# EAGLE board NAMUR (EAGLE 9.6.2)
ВНАР.301411.138 Сателлит-Р. Плата субблока ВТИ-8 (Р05)
NOABS_DPI: 600; NOABS_FINISH: ENIG (gold); NOABS_LEAVE_ARTIFACTS: 0; NOABS_MASK: Blue; NOABS_MERGE: 1; NOABS_MIN_PRIORITY3D: 0; NOABS_PHOTO_VIAS: 1; NOABS_SILK: White; RAILS_ANGLE: 180.000000; RAILS_WIDTH: 0.000000; RAILS_X: 22.500000; RAILS_Y: 75.500000
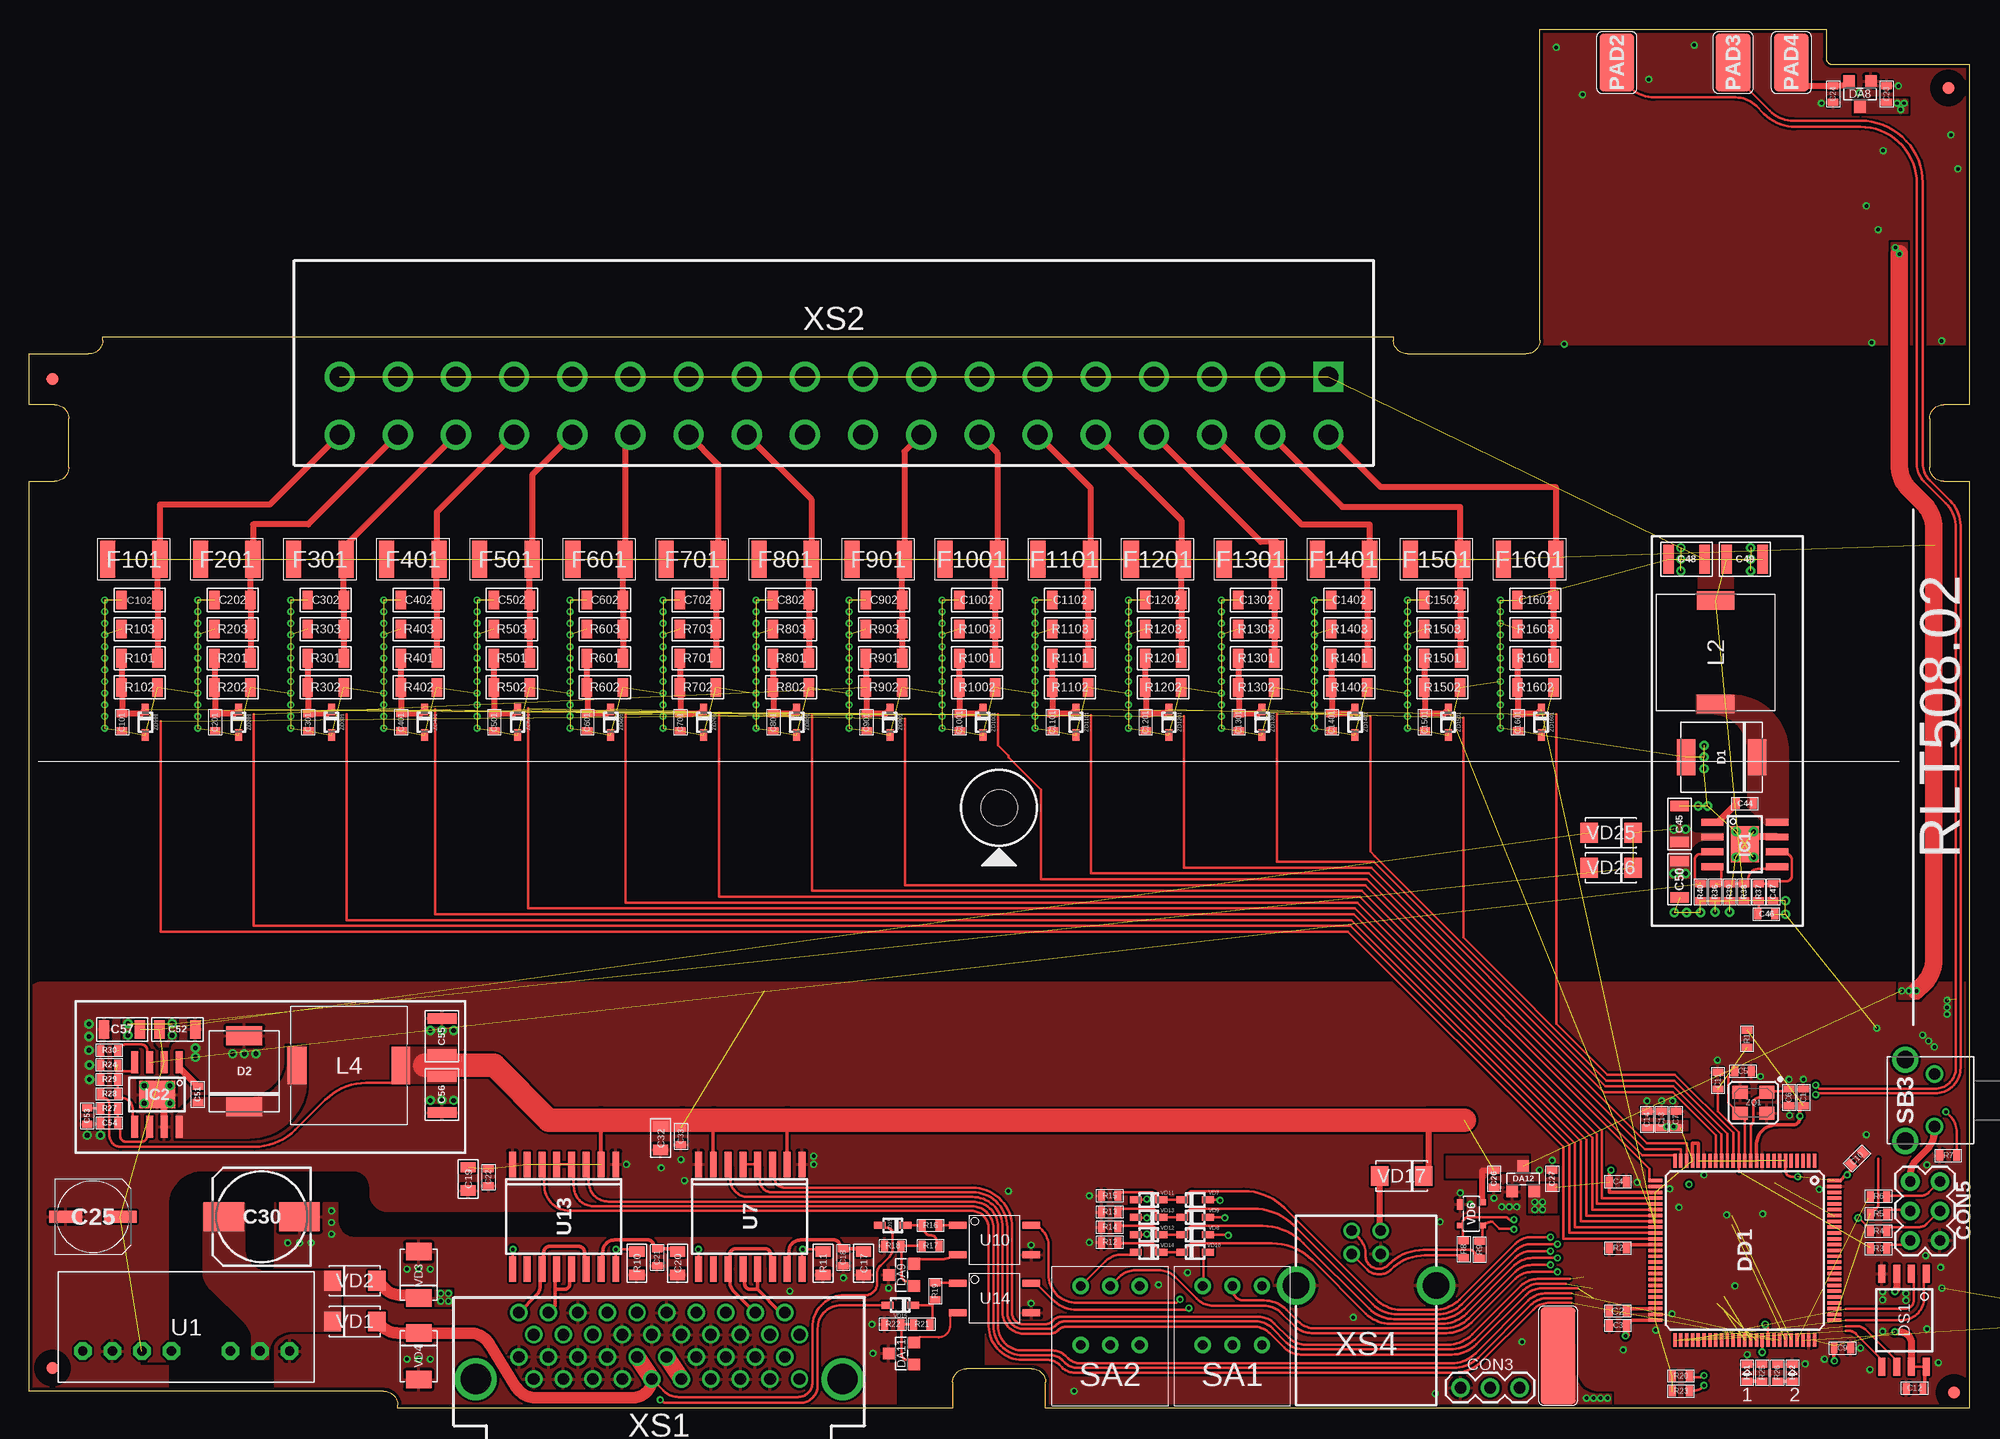
[diagram p6: board, top side]
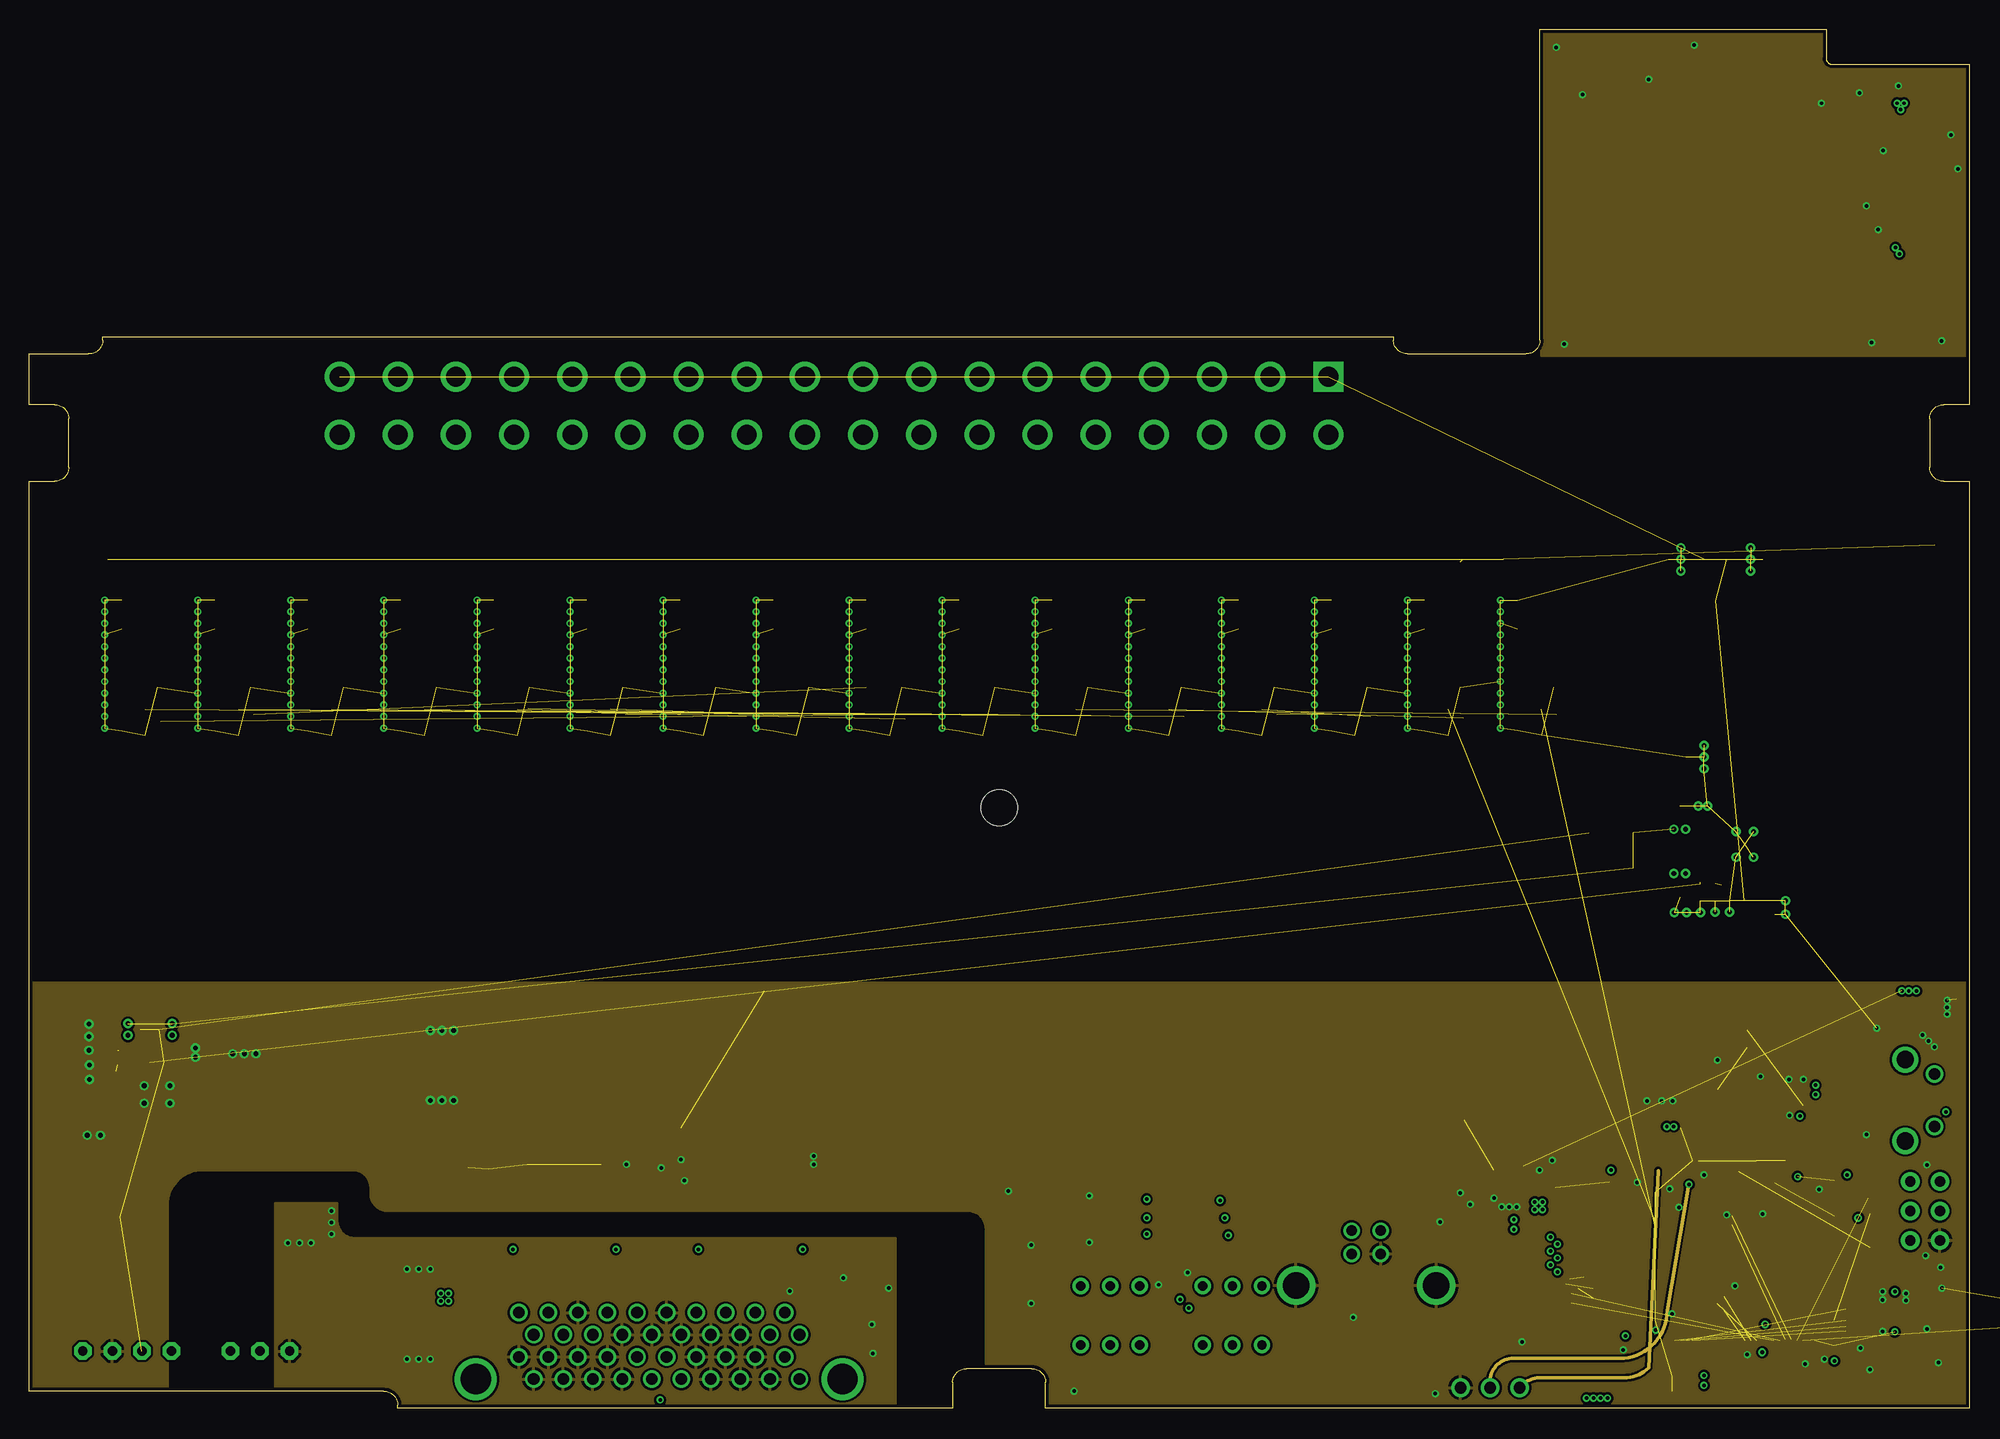
[diagram p7: board, inner layer Route2]
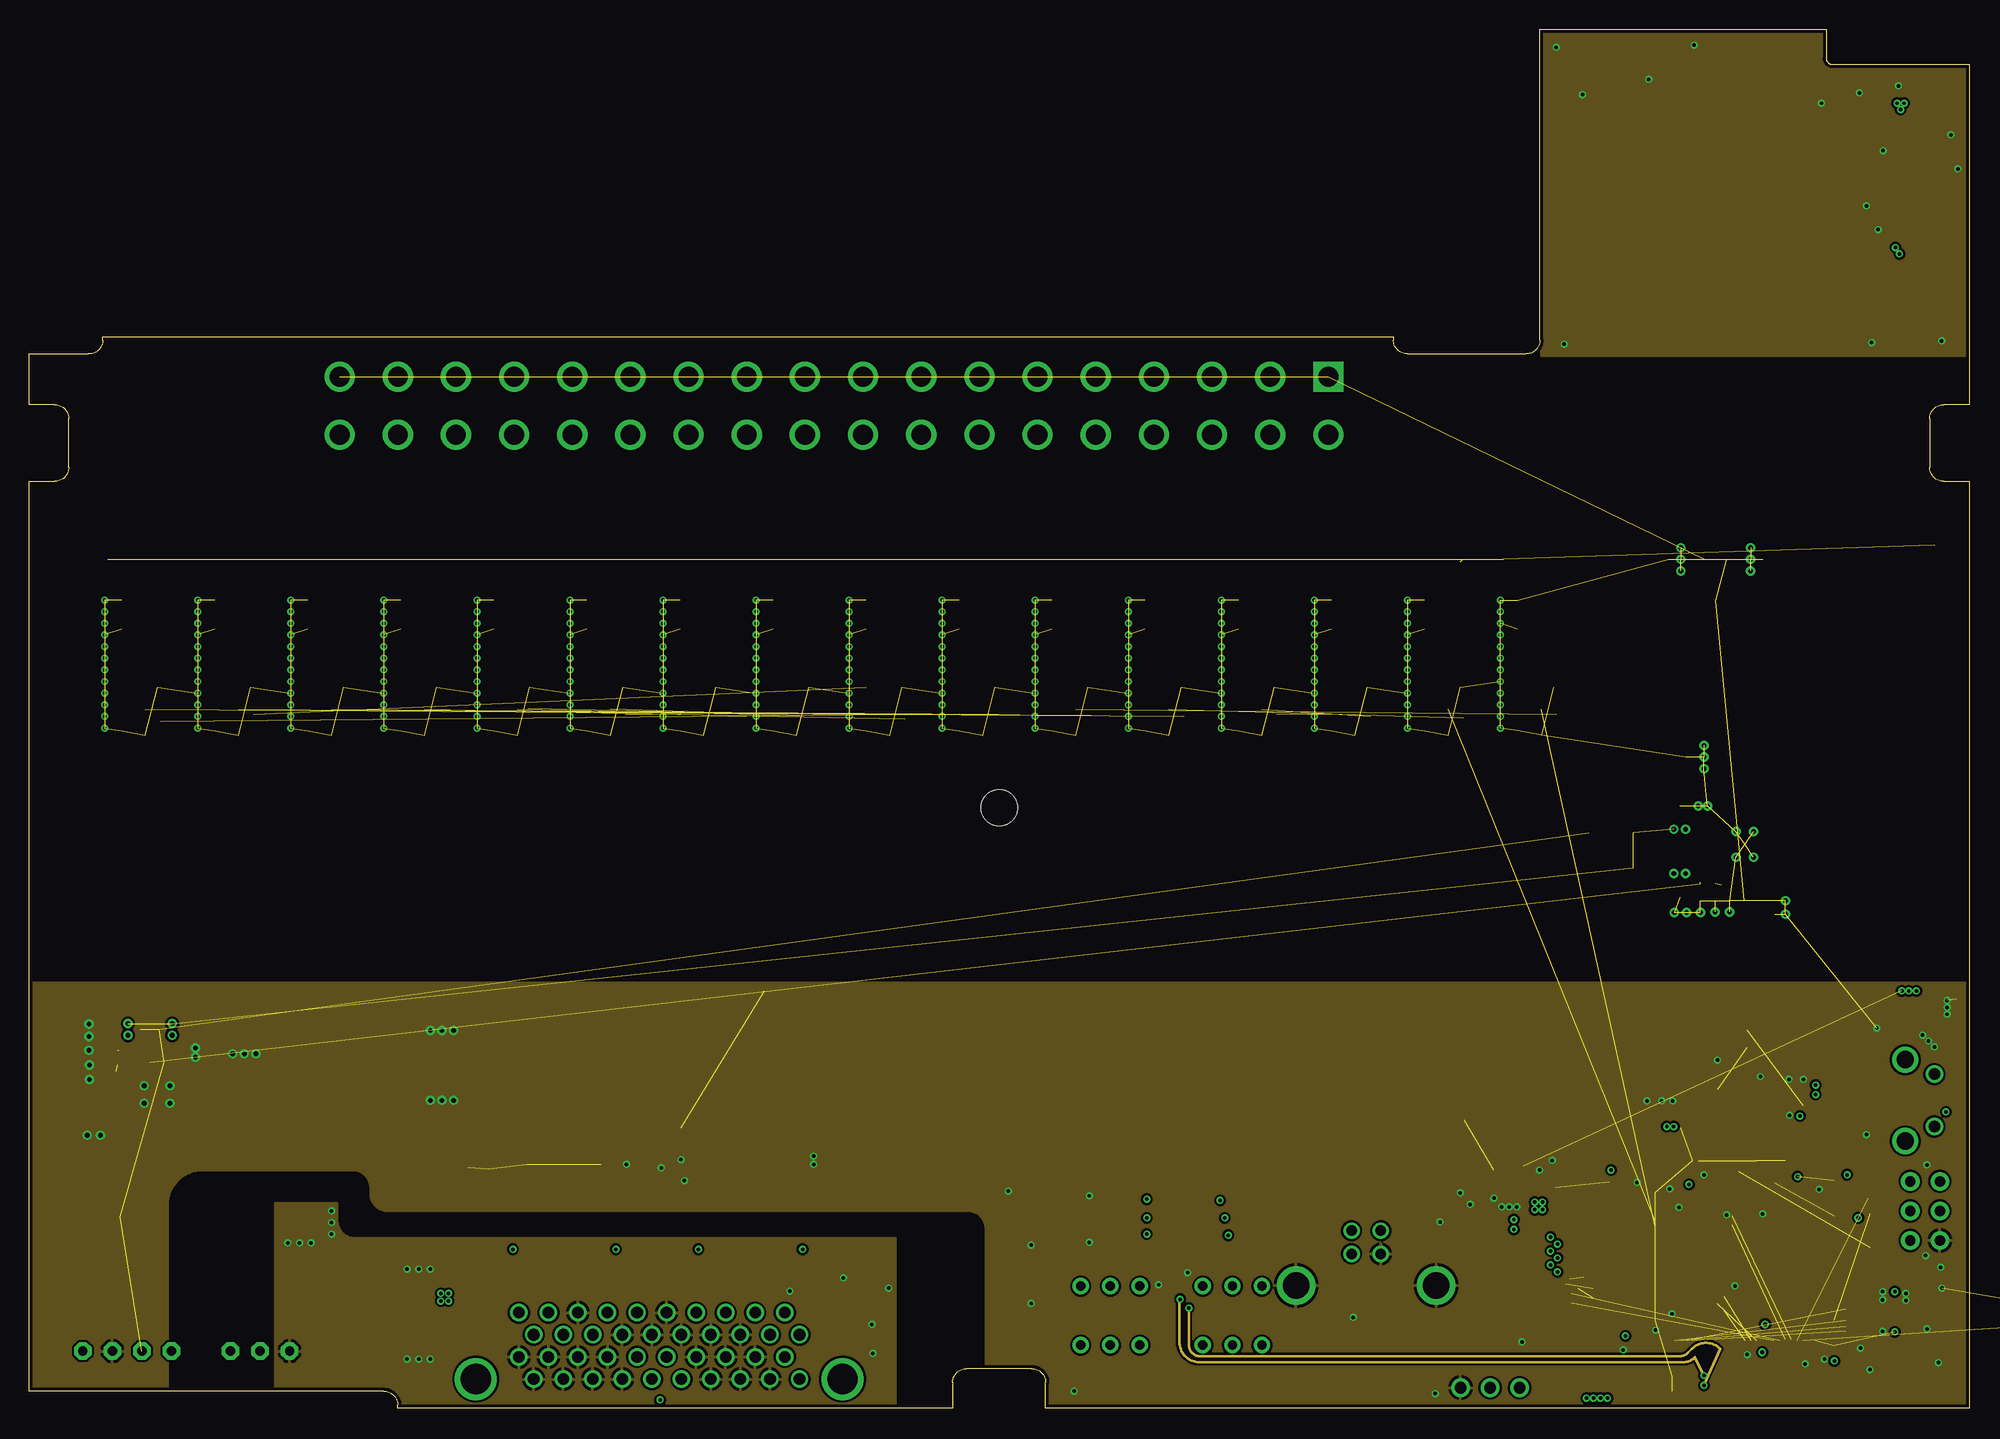
[diagram p8: board, inner layer Route15]
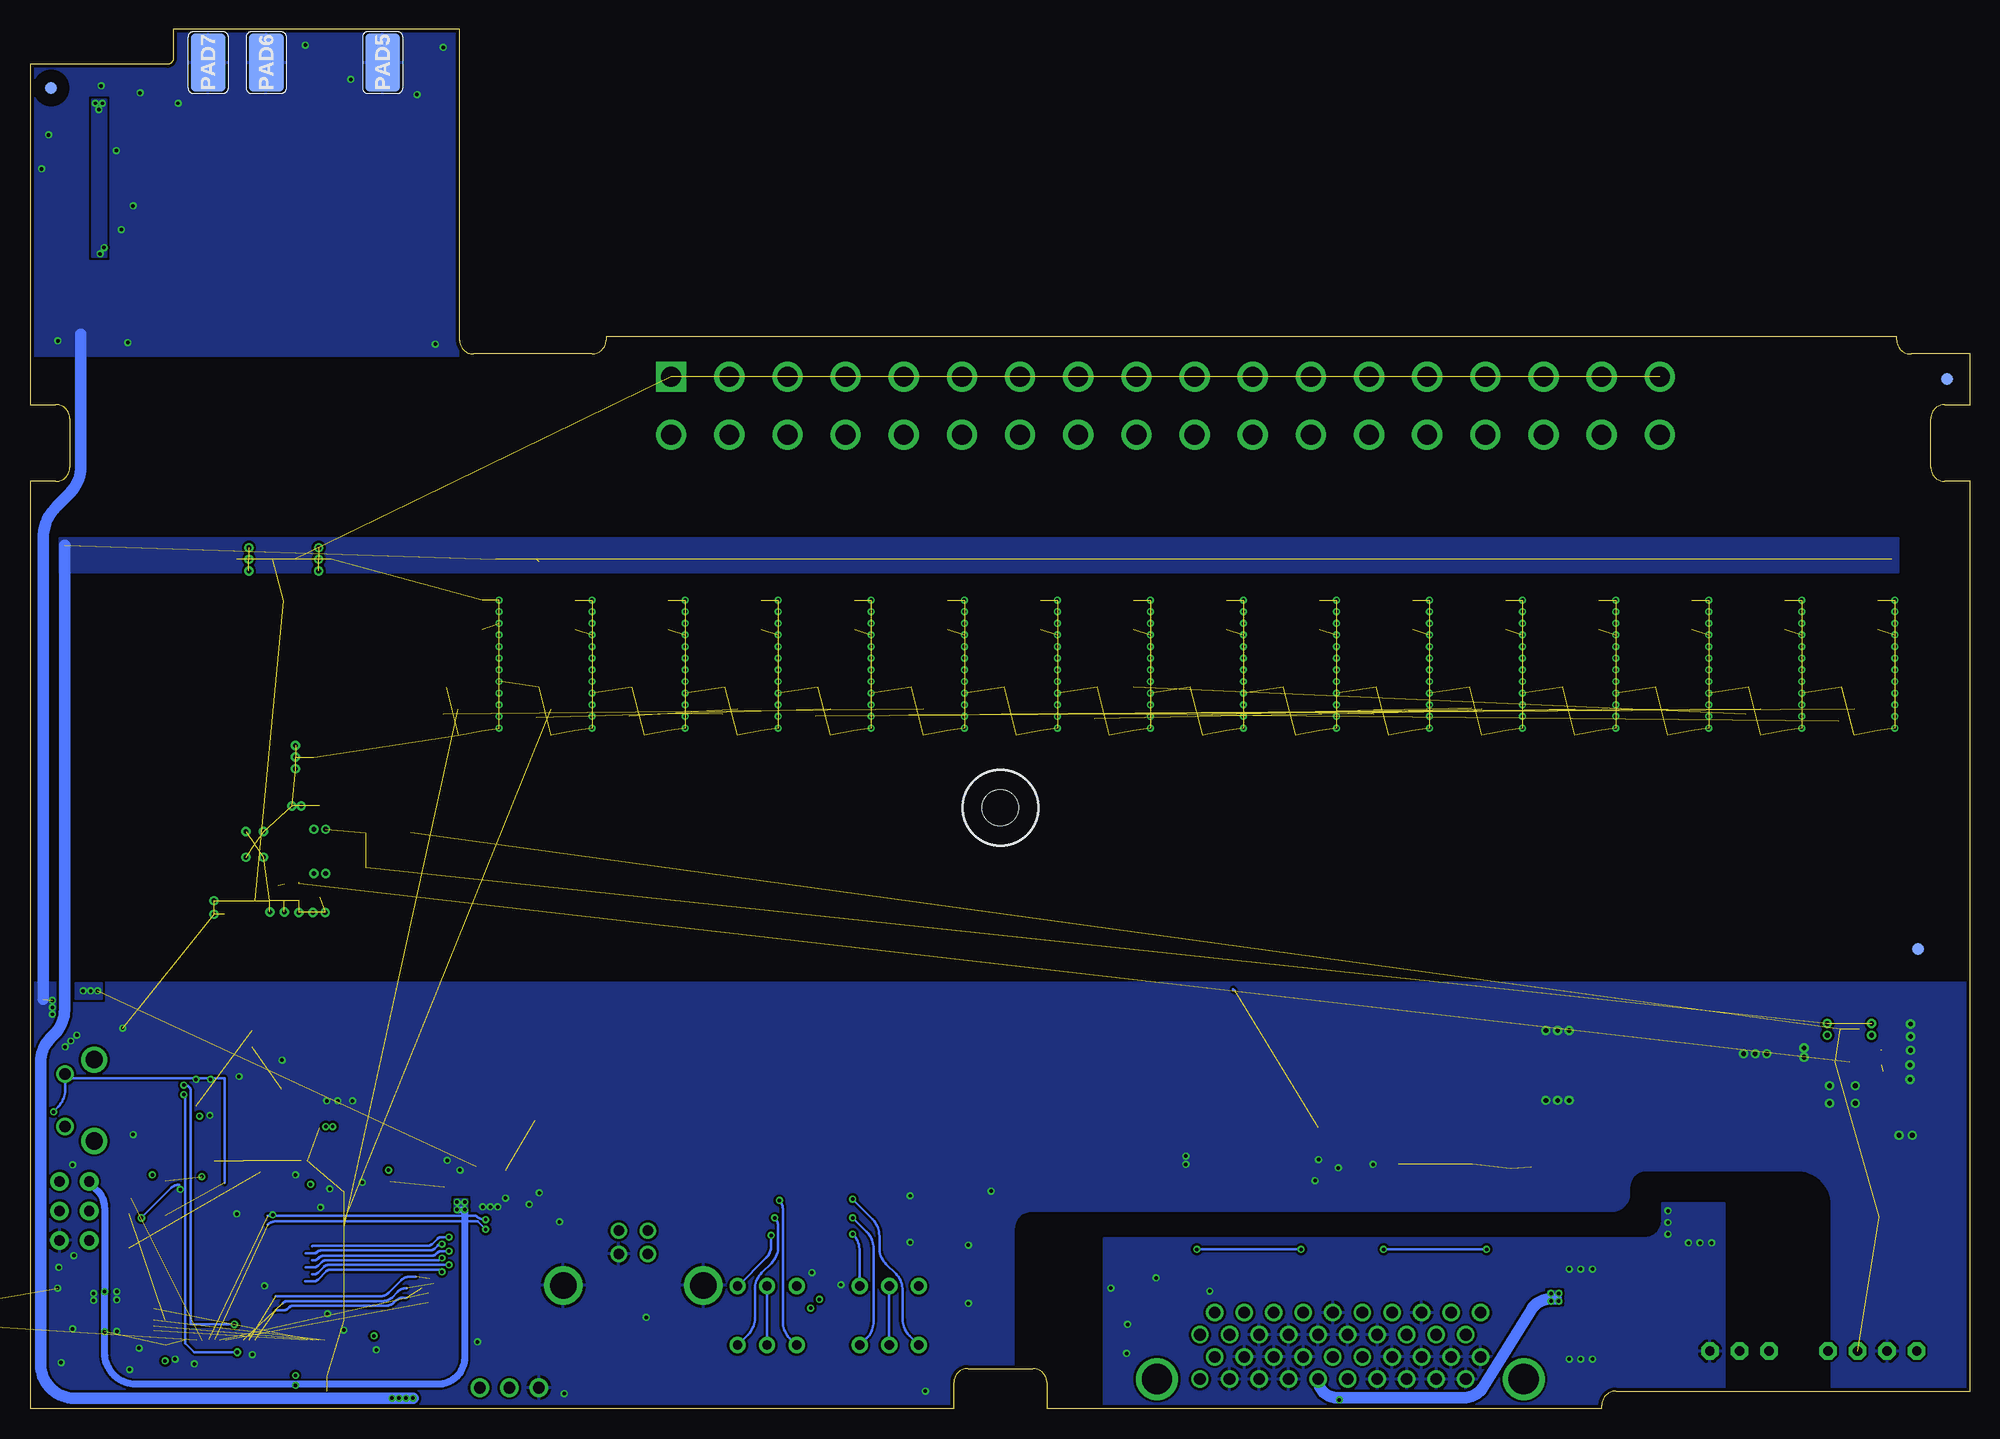
[diagram p9: board, bottom side, seen from below]

Size 166.8 x 118.5 mm. Coordinates in mm from the lower left corner, seen from the top.
Outline: 0,90.6 5.1,90.6 arc90 6.35,91.8 6.35,92.1 117.3,92.1 117.3,91.8 arc90 118.5,90.6 128.7,90.6 arc90 129.9,91.8 129.9,118.5 154.5,118.5 154.5,116 arc90 155,115.5 166.8,115.5 166.8,86.25 164.6,86.25 arc90 163.4,85.05 163.4,80.85 arc90 164.6,79.65 166.8,79.65 166.8,0 87.4,0 87.4,2.2 arc90 86.2,3.4 80.6,3.4 arc90 79.4,2.2 79.4,0 31.7,0 31.7,0.25 arc90 30.5,1.45 0,1.45 0,79.65 2.2,79.65 arc90 3.4,80.85 3.4,85.05 arc90 2.2,86.25 0,86.25 0,90.6
Copper layers (1+2*15+16): Top 0.035mm / dielectric 1.43mm / Route2 0.035mm / dielectric 0.15mm / Route15 0.035mm / dielectric 0.2mm / Bottom 0.035mm
Design rules "Rezonit 2 layer *": minimum track width 6mil, minimum drill 0.3mm, track to track 0.2mm, track to pad 0.2mm, pad to pad 0.2mm, via to via 0.2mm, smd to smd 0.2mm, copper to edge 0.3mm, drill to drill 6mil, minimum pad ring 0.15mm, minimum via ring 0.15mm, stop-mask expansion 0.05mm, vias tented up to drill 0.5mm, thermal gap 10mil
Net classes: 1 HV: clearance 0.3 mm to class 0, clearance 0.3 mm
Holes 3.1 mm at 83.4,51.6
tRestrict: 1 lines

## Footprints (pad centres in the part's own frame; a part is rotated, then mirrored left to right if it is on the bottom)
C0603 = smd 0.6 x 0.9: 1 -0.725,0; 2 0.725,0
C0805 = smd 0.9 x 1.3: 1 -1,0; 2 1,0
CAP_SMD_6.3X7.7 = smd 2.8 x 1: + 2.35,0; - -2.35,0
SMD-0810 = smd 3.5 x 2.5: + 3.25,0; - -3.25,0
C1206 = smd 0.9 x 1.6: P$1 -1.55,0; P$2 1.55,0
C1210 = smd 0.9 x 2.5: 1 -1.55,0; 2 1.55,0
PLS3 = drill 1 pad 1.6: 1 -2.54,0; 2 0,0; 3 2.54,0
PLD6 = drill 0.9 pad 1.6: 1 -2.54,-1.27; 2 -2.54,1.27; 3 0,-1.27; 4 0,1.27; 5 2.54,-1.27; 6 2.54,1.27
DO-214AB(SMC) = smd 1.6 x 3.1: A -3.05,0; C 3.05,0
SOT23-3 = smd 1 x 1: 1 -1.1,0.95; 2 -1.1,-0.95; 3 1.1,0
LQFP100 = smd 1.2 x 0.3: 1 -7.7,6; 2 -7.7,5.5; 3 -7.7,5; 4 -7.7,4.5; 5 -7.7,4; 6 -7.7,3.5; 7 -7.7,3; 8 -7.7,2.5; 9 -7.7,2; 10 -7.7,1.5; 11 -7.7,1; 12 -7.7,0.5; 13 -7.7,0; 14 -7.7,-0.5; 15 -7.7,-1; 16 -7.7,-1.5; 17 -7.7,-2; 18 -7.7,-2.5; 19 -7.7,-3; 20 -7.7,-3.5; 21 -7.7,-4; 22 -7.7,-4.5; 23 -7.7,-5; 24 -7.7,-5.5; 25 -7.7,-6; 51 7.7,-6; 52 7.7,-5.5; 53 7.7,-5; 54 7.7,-4.5; 55 7.7,-4; 56 7.7,-3.5; 57 7.7,-3; 58 7.7,-2.5; 59 7.7,-2; 60 7.7,-1.5; 61 7.7,-1; 62 7.7,-0.5; 63 7.7,0; 64 7.7,0.5; 65 7.7,1; 66 7.7,1.5; 67 7.7,2; 68 7.7,2.5; 69 7.7,3; 70 7.7,3.5; 71 7.7,4; 72 7.7,4.5; 73 7.7,5; 74 7.7,5.5; 75 7.7,6 | smd 0.3 x 1.2: 26 -6,-7.7; 27 -5.5,-7.7; 28 -5,-7.7; 29 -4.5,-7.7; 30 -4,-7.7; 31 -3.5,-7.7; 32 -3,-7.7; 33 -2.5,-7.7; 34 -2,-7.7; 35 -1.5,-7.7; 36 -1,-7.7; 37 -0.5,-7.7; 38 0,-7.7; 39 0.5,-7.7; 40 1,-7.7; 41 1.5,-7.7; 42 2,-7.7; 43 2.5,-7.7; 44 3,-7.7; 45 3.5,-7.7; 46 4,-7.7; 47 4.5,-7.7; 48 5,-7.7; 49 5.5,-7.7; 50 6,-7.7; 76 6,7.7; 77 5.5,7.7; 78 5,7.7; 79 4.5,7.7; 80 4,7.7; 81 3.5,7.7; 82 3,7.7; 83 2.5,7.7; 84 2,7.7; 85 1.5,7.7; 86 1,7.7; 87 0.5,7.7; 88 0,7.7; 89 -0.5,7.7; 90 -1,7.7; 91 -1.5,7.7; 92 -2,7.7; 93 -2.5,7.7; 94 -3,7.7; 95 -3.5,7.7; 96 -4,7.7; 97 -4.5,7.7; 98 -5,7.7; 99 -5.5,7.7; 100 -6,7.7
SOIC8-208MIL = smd 1.55 x 0.6: 1 -4,1.905; 2 -4,0.635; 3 -4,-0.635; 4 -4,-1.905; 5 4,-1.905; 6 4,-0.635; 7 4,0.635; 8 4,1.905
S30-A90X = smd 1.3 x 3.2: 1 -2.25,0; 2 2.25,0
FIDUCIAL_MOUNT = smd 1.016 x 1.016: P$1 0,0
LED0603 = smd 0.6 x 0.9: A 0.725,0; C -0.725,0
SOIC8-POWERPAD = smd 0.6 x 1.9: 1 -1.905,-2.78; 2 -0.635,-2.78; 3 0.635,-2.78; 4 1.905,-2.78; 5 1.905,2.78; 6 0.635,2.78; 7 -0.635,2.78; 8 -1.905,2.78 | smd 3.1 x 2.4: POWERPAD 0,0
CDRH105R = smd 1.6 x 3.2: 1 -4.45,0; 2 4.45,0
8.3X3 = smd 3 x 8.3: P$1 0,0
5X3 = smd 5 x 3: P$1 0,0
R0603 = smd 0.6 x 0.9: 1 -0.725,0; 2 0.725,0
R0805 = smd 0.9 x 1.3: 1 -1,0; 2 1,0
R1206 = smd 0.9 x 1.6: P$1 -1.55,0; P$2 1.55,0
DRD16RAE04 = drill 0.8 pad 1.4: 1 2.54,2.54; 2 -2.54,-2.54; 4 -2.54,2.54; 8 2.54,-2.54; C_1 0,-2.54; C_2 0,2.54
KLS7-TS6606-5.0-180 = drill 1: 1 -2.25,2.5; 2 2.25,2.5 | drill 1.5: H1 -3.5,0; H2 3.5,0
URB_S-6WR3 = drill 0.8 pad 1.5 octagon: 1 -8.9,2.05; 2 -6.36,2.05; 3 -3.82,2.05; 5 1.26,2.05; 6 3.8,2.05; 7 6.34,2.05; 8 8.88,2.05
SOIC16-300MIL = smd 2.2 x 0.6: 1 -4.5,4.445; 2 -4.5,3.175; 3 -4.5,1.905; 4 -4.5,0.635; 5 -4.5,-0.635; 6 -4.5,-1.905; 7 -4.5,-3.175; 8 -4.5,-4.445; 9 4.5,-4.445; 10 4.5,-3.175; 11 4.5,-1.905; 12 4.5,-0.635; 13 4.5,0.635; 14 4.5,1.905; 15 4.5,3.175; 16 4.5,4.445
SOP-4 = smd 1.5 x 0.6: 1 -3.175,1.27; 2 -3.175,-1.27; 3 3.175,-1.27; 4 3.175,1.27
DO-214AC(SMA) = smd 1.5 x 1.7: A -1.9,0; C 1.9,0
DO-214AA(SMB) = smd 1.5 x 2.2: A -2,0; C 2,0
SOT143B = smd 0.6 x 0.9: 1 -0.95,0.8 | smd 0.6 x 0.5: 2 -0.95,-1; 3 0.95,-1; 4 0.95,1
SOD323 = smd 1 x 0.6: A -1.1,0; C 1.1,0
1734037-4 = drill 1 pad 1.5: A1 10.79,7.025; A2 8.25,7.025; A3 5.71,7.025; A4 3.17,7.025; A5 0.63,7.025; A6 -1.91,7.025; A7 -4.45,7.025; A8 -6.99,7.025; A9 -9.53,7.025; A10 -12.07,7.025; B1 12.06,5.12; B2 9.52,5.12; B3 6.98,5.12; B4 4.44,5.12; B5 1.9,5.12; B6 -0.64,5.12; B7 -3.18,5.12; B8 -5.72,5.12; B9 -8.26,5.12; B10 -10.8,5.12; C1 10.79,3.215; C2 8.25,3.215; C3 5.71,3.215; C4 3.17,3.215; C5 0.63,3.215; C6 -1.91,3.215; C7 -4.45,3.215; C8 -6.99,3.215; C9 -9.53,3.215; C10 -12.07,3.215; D1 12.06,1.31; D2 9.52,1.31; D3 6.98,1.31; D4 4.44,1.31; D5 1.9,1.31; D6 -0.64,1.31; D7 -3.18,1.31; D8 -5.72,1.31; D9 -8.26,1.31; D10 -10.8,1.31 | drill 2.6 pad 3.5: UN_1 15.765,7.025; UN_2 -15.765,7.025
CCDN2.5_18-G1P26THR = drill 1.7 pad 2.6 square: A1 42.5,0 | drill 1.7 pad 2.6: A2 37.5,0; A3 32.5,0; A4 27.5,0; A5 22.5,0; A6 17.5,0; A7 12.5,0; A8 7.5,0; A9 2.5,0; A10 -2.5,0; A11 -7.5,0; A12 -12.5,0; A13 -17.5,0; A14 -22.5,0; A15 -27.5,0; A16 -32.5,0; A17 -37.5,0; A18 -42.5,0; B1 42.5,-5; B2 37.5,-5; B3 32.5,-5; B4 27.5,-5; B5 22.5,-5; B6 17.5,-5; B7 12.5,-5; B8 7.5,-5; B9 2.5,-5; B10 -2.5,-5; B11 -7.5,-5; B12 -12.5,-5; B13 -17.5,-5; B14 -22.5,-5; B15 -27.5,-5; B16 -32.5,-5; B17 -37.5,-5; B18 -42.5,-5
USB-B = drill 0.9 pad 1.4: 1 -1.25,-4.71; 2 1.25,-4.71; 3 1.25,-2.71; 4 -1.25,-2.71 | drill 2.3 pad 2.7: 5_1 6.02,0; 5_2 -6.02,0
OSCILLATOR-3.2X2.5-4P = smd 1.3 x 1.1: 1 -1.15,-0.9; 2 1.15,-0.9; 3 1.15,0.9; 4 -1.15,0.9

## Placement (x,y rotation side)
C1  0.1u  [C0603]  152.55,26.7 270 top
C2  2.2u  [C0603]  136.6,8.35 0 top
C3  0.1u  [C0603]  136.6,7.1 0 top
C4  0.1u  [C0603]  136.6,19.45 180 top
C5  12p  [C0603]  147.35,28.95 180 top
C6  12p  [C0603]  151.3,26.7 270 top
C7  0.1u  [C0603]  141.6,24.8 270 top
C8  2.2u  [C0603]  173.95,7.95 270 top  (outside the outline)
C9  0.1u  [C0603]  155.9,5.15 180 top
C10  0.1u  [C0603]  157.15,21.44 45 top
C11  0.1u  [C0603]  145.2,28.15 270 top
C12  0.1u  [C0603]  162.1,1.7 0 top
C13  0.1u  [C0603]  140.35,24.8 270 top
C14  1u  [C0603]  139.1,24.8 270 top
C17  10u  [C0805]  71.75,12.45 270 top
C18  0.1u  [C0603]  70,12.95 270 top
C19  10u  [C0805]  37.75,19.7 90 top
C20  10u  [C0805]  55.75,12.45 270 top
C21  0.1u  [C0603]  54,12.95 270 top
C22  0.1u  [C0603]  39.5,19.85 90 top
C23  0.1u  [C0603]  159.7,112.95 270 top
C24  0.1u  [C0603]  155.1,112.95 90 top
C25  22u  [CAP_SMD_6.3X7.7]  5.5,16.45 0 top
C26  0.1u  [C0603]  125.95,19.7 90 top
C27  0.1u  [C0603]  130.95,19.7 270 top
C30  100u  [SMD-0810]  20,16.45 180 top
C32  10u  [C0805]  54.3,23.2 90 top
C33  0.1u  [C0603]  56.05,23.35 90 top
C44  0.1u  [C0603]  147.5,51.95 0 top
C45  2.2u  [C1206]  141.9,50.2 270 top
C46  6800p  [C0603]  149.35,42.45 180 top
C47  39p  [C0603]  149.95,44.35 90 top
C48  10u  [C1210]  142.5,72.95 0 top
C49  10u  [C1210]  147.5,72.95 180 top
C50  2.2u  [C1206]  141.9,45.45 90 top
C51  0.1u  [C0603]  14.5,26.95 270 top
C52  2.2u  [C1206]  12.75,32.55 180 top
C53  6800p  [C0603]  5,25.1 90 top
C54  39p  [C0603]  6.9,24.5 0 top
C55  10u  [C1210]  35.5,31.95 270 top
C56  10u  [C1210]  35.5,26.95 90 top
C57  2.2u  [C1206]  8,32.55 0 top
C101  10n  [C0603]  8,58.95 90 top
C102  4700p  [C1206]  9.5,69.45 0 top
C201  10n  [C0603]  16,58.95 90 top
C202  4700p  [C1206]  17.5,69.45 0 top
C301  10n  [C0603]  24,58.95 90 top
C302  4700p  [C1206]  25.5,69.45 0 top
C401  10n  [C0603]  32,58.95 90 top
C402  4700p  [C1206]  33.5,69.45 0 top
C501  10n  [C0603]  40,58.95 90 top
C502  4700p  [C1206]  41.5,69.45 0 top
C601  10n  [C0603]  48,58.95 90 top
C602  4700p  [C1206]  49.5,69.45 0 top
C701  10n  [C0603]  56,58.95 90 top
C702  4700p  [C1206]  57.5,69.45 0 top
C801  10n  [C0603]  64,58.95 90 top
C802  4700p  [C1206]  65.5,69.45 0 top
C901  10n  [C0603]  72,58.95 90 top
C902  4700p  [C1206]  73.5,69.45 0 top
C1001  10n  [C0603]  80,58.95 90 top
C1002  4700p  [C1206]  81.5,69.45 0 top
C1101  10n  [C0603]  88,58.95 90 top
C1102  4700p  [C1206]  89.5,69.45 0 top
C1201  10n  [C0603]  96,58.95 90 top
C1202  4700p  [C1206]  97.5,69.45 0 top
C1301  10n  [C0603]  104,58.95 90 top
C1302  4700p  [C1206]  105.5,69.45 0 top
C1401  10n  [C0603]  112,58.95 90 top
C1402  4700p  [C1206]  113.5,69.45 0 top
C1501  10n  [C0603]  120,58.95 90 top
C1502  4700p  [C1206]  121.5,69.45 0 top
C1601  10n  [C0603]  128,58.95 90 top
C1602  4700p  [C1206]  129.5,69.45 0 top
CON3  PINHEAD_1X03-2.54  [PLS3]  125.6,1.75 0 top
CON5  PINHEAD_2X03-PTH-2.54  [PLD6]  163,16.95 270 top
D1  B560C  [DO-214AB(SMC)]  145.5,55.95 0 top
D2  B560C  [DO-214AB(SMC)]  18.5,28.95 270 top
DA8  XC6206P332  [SOT23-3]  157.4,112.95 270 top
DA9  TL431  [SOT23-3]  75,11.45 180 top
DA11  TL431  [SOT23-3]  75,4.7 180 top
DA12  XC6206P332  [SOT23-3]  128.45,19.7 90 top
DD1  STM32F411VCT6  [LQFP100]  147.5,13.55 270 top
DS1  AT25DF321A  [SOIC8-208MIL]  161.2,7.55 270 top
F101  SURGE_ARRESTER-S30-A90X  [S30-A90X]  9,72.95 180 top
F201  SURGE_ARRESTER-S30-A90X  [S30-A90X]  17,72.95 180 top
F301  SURGE_ARRESTER-S30-A90X  [S30-A90X]  25,72.95 180 top
F401  SURGE_ARRESTER-S30-A90X  [S30-A90X]  33,72.95 180 top
F501  SURGE_ARRESTER-S30-A90X  [S30-A90X]  41,72.95 180 top
F601  SURGE_ARRESTER-S30-A90X  [S30-A90X]  49,72.95 180 top
F701  SURGE_ARRESTER-S30-A90X  [S30-A90X]  57,72.95 180 top
F801  SURGE_ARRESTER-S30-A90X  [S30-A90X]  65,72.95 180 top
F901  SURGE_ARRESTER-S30-A90X  [S30-A90X]  73,72.95 180 top
F1001  SURGE_ARRESTER-S30-A90X  [S30-A90X]  81,72.95 180 top
F1101  SURGE_ARRESTER-S30-A90X  [S30-A90X]  89,72.95 180 top
F1201  SURGE_ARRESTER-S30-A90X  [S30-A90X]  97,72.95 180 top
F1301  SURGE_ARRESTER-S30-A90X  [S30-A90X]  105,72.95 180 top
F1401  SURGE_ARRESTER-S30-A90X  [S30-A90X]  113,72.95 180 top
F1501  SURGE_ARRESTER-S30-A90X  [S30-A90X]  121,72.95 180 top
F1601  SURGE_ARRESTER-S30-A90X  [S30-A90X]  129,72.95 180 top
FD1  FIDUCIALMOUNT  [FIDUCIAL_MOUNT]  2,88.45 0 top
FD2  FIDUCIALMOUNT  [FIDUCIAL_MOUNT]  165,113.45 0 top
FD3  FIDUCIALMOUNT  [FIDUCIAL_MOUNT]  2,3.45 0 top
FD4  FIDUCIALMOUNT  [FIDUCIAL_MOUNT]  165.5,1.35 0 top
FD5  FIDUCIALMOUNT  [FIDUCIAL_MOUNT]  2,88.45 0 bottom
FD6  FIDUCIALMOUNT  [FIDUCIAL_MOUNT]  165,113.45 0 bottom
FD7  FIDUCIALMOUNT  [FIDUCIAL_MOUNT]  4.5,39.45 0 bottom
HL1  LED-0603  [LED0603]  147.7,3.05 270 top
HL2  LED-0603  [LED0603]  151.6,3.05 270 top
IC1  TPS54360  [SOIC8-POWERPAD]  147.5,48.45 270 top
IC2  TPS54360  [SOIC8-POWERPAD]  11,26.95 180 top
L2  8.2uH  [CDRH105R]  145,64.95 90 top
L4  8.2uH  [CDRH105R]  27.5,29.45 0 top
PAD1  PAD-8.3X3  [8.3X3]  131.45,4.5 0 top
PAD2  PAD-5X3  [5X3]  136.5,115.65 90 top
PAD3  PAD-5X3  [5X3]  146.5,115.65 90 top
PAD4  PAD-5X3  [5X3]  151.5,115.65 90 top
PAD5  PAD-5X3  [5X3]  136.5,115.65 90 bottom
PAD6  PAD-5X3  [5X3]  146.5,115.65 90 bottom
PAD7  PAD-5X3  [5X3]  151.5,115.65 90 bottom
R1  10K  [R0603]  147.7,31.75 90 top
R2  10K  [R0603]  136.6,13.75 0 top
R3  22R  [R0603]  159,13.7 0 top
R4  22R  [R0603]  159,15.2 0 top
R5  22R  [R0603]  159,16.7 0 top
R6  22R  [R0603]  159,18.2 0 top
R7  10K  [R0603]  165,21.7 0 top
R8  22R  [R0603]  123.35,13.65 270 top
R9  22R  [R0603]  124.7,13.6 270 top
R10  000  [R0805]  52.25,12.45 90 top
R11  000  [R0805]  68.25,12.45 90 top
R12  10K  [R0603]  92.9,14.25 0 top
R13  10K  [R0603]  92.9,16.85 0 top
R14  10K  [R0603]  92.9,15.55 0 top
R15  10K  [R0603]  92.9,18.25 0 top
R16  4K7  [R0603]  77.5,15.7 180 top
R17  75K  [R0603]  77.5,13.95 180 top
R18  24K  [R0603]  74.25,13.95 180 top
R19  4K7  [R0603]  77.9,10.05 270 top
R20  10K  [R0603]  142,2.75 180 top
R21  75K  [R0603]  76.75,7.2 180 top
R22  24K  [R0603]  74.25,7.2 180 top
R23  10K  [R0603]  142,1.45 180 top
R24  143K  [R0603]  6.9,29.5 0 top
R25  1K  [R0603]  149,3.05 270 top
R26  1K  [R0603]  150.3,3.05 270 top
R27  18K  [R0603]  6.9,25.75 0 top
R28  53K6  [R0603]  6.9,27 180 top
R29  10K  [R0603]  6.9,28.25 0 top
R30  18K  [R0603]  6.9,30.75 0 top
R36  143K  [R0603]  144.95,44.35 90 top
R37  18K  [R0603]  148.7,44.35 90 top
R38  75K  [R0603]  147.45,44.35 270 top
R39  8K2  [R0603]  146.2,44.35 90 top
R40  18K  [R0603]  143.7,44.35 90 top
R101  47K  [R1206]  9.5,64.45 0 top
R102  33K  [R1206]  9.5,61.95 180 top
R103  1K  [R1206]  9.5,66.95 0 top
R201  47K  [R1206]  17.5,64.45 0 top
R202  33K  [R1206]  17.5,61.95 180 top
R203  1K  [R1206]  17.5,66.95 0 top
R301  47K  [R1206]  25.5,64.45 0 top
R302  33K  [R1206]  25.5,61.95 180 top
R303  1K  [R1206]  25.5,66.95 0 top
R401  47K  [R1206]  33.5,64.45 0 top
R402  33K  [R1206]  33.5,61.95 180 top
R403  1K  [R1206]  33.5,66.95 0 top
R501  47K  [R1206]  41.5,64.45 0 top
R502  33K  [R1206]  41.5,61.95 180 top
R503  1K  [R1206]  41.5,66.95 0 top
R601  47K  [R1206]  49.5,64.45 0 top
R602  33K  [R1206]  49.5,61.95 180 top
R603  1K  [R1206]  49.5,66.95 0 top
R701  47K  [R1206]  57.5,64.45 0 top
R702  33K  [R1206]  57.5,61.95 180 top
R703  1K  [R1206]  57.5,66.95 0 top
R801  47K  [R1206]  65.5,64.45 0 top
R802  33K  [R1206]  65.5,61.95 180 top
R803  1K  [R1206]  65.5,66.95 0 top
R901  47K  [R1206]  73.5,64.45 0 top
R902  33K  [R1206]  73.5,61.95 180 top
R903  1K  [R1206]  73.5,66.95 0 top
R1001  47K  [R1206]  81.5,64.45 0 top
R1002  33K  [R1206]  81.5,61.95 180 top
R1003  1K  [R1206]  81.5,66.95 0 top
R1101  47K  [R1206]  89.5,64.45 0 top
R1102  33K  [R1206]  89.5,61.95 180 top
R1103  1K  [R1206]  89.5,66.95 0 top
R1201  47K  [R1206]  97.5,64.45 0 top
R1202  33K  [R1206]  97.5,61.95 180 top
R1203  1K  [R1206]  97.5,66.95 0 top
R1301  47K  [R1206]  105.5,64.45 0 top
R1302  33K  [R1206]  105.5,61.95 180 top
R1303  1K  [R1206]  105.5,66.95 0 top
R1401  47K  [R1206]  113.5,64.45 0 top
R1402  33K  [R1206]  113.5,61.95 180 top
R1403  1K  [R1206]  113.5,66.95 0 top
R1501  47K  [R1206]  121.5,64.45 0 top
R1502  33K  [R1206]  121.5,61.95 180 top
R1503  1K  [R1206]  121.5,66.95 0 top
R1601  47K  [R1206]  129.5,64.45 0 top
R1602  33K  [R1206]  129.5,61.95 180 top
R1603  1K  [R1206]  129.5,66.95 0 top
SA1  DRD16RAE04  [DRD16RAE04]  103.45,7.95 180 top
SA2  DRD16RAE04  [DRD16RAE04]  92.95,7.95 180 top
SB3  TACT_SWITCH-KLS-KLS7-TS6606  [KLS7-TS6606-5.0-180]  161.3,26.45 270 top
SCR1  SCREW-M3-D3.1  [PCB_SCREW_M3-D3.1]  83.4,51.6 0 top
U1  URB2424S-6WR3  [URB_S-6WR3]  13.5,6.95 180 top
U7  NSIP83086(V)  [SOIC16-300MIL]  62,16.45 270 top
U10  KAQY214-SOP-4  [SOP-4]  83,14.45 0 top
U13  NSIP83086(V)  [SOIC16-300MIL]  46,16.45 270 top
U14  KAQY214-SOP-4  [SOP-4]  83,9.45 0 top
VD1  SS34  [DO-214AC(SMA)]  28,7.45 180 top
VD2  SS34  [DO-214AC(SMA)]  28,10.95 180 top
VD3  SMBJ24CA-SMB  [DO-214AA(SMB)]  33.5,11.45 270 top
VD4  SMBJ24CA-SMB  [DO-214AA(SMB)]  33.5,4.45 90 top
VD6  PRTR5V0U2X  [SOT143B]  124,16.7 0 top
VD7  BAT54JFILM  [SOD323]  100.25,17.9 180 top
VD8  BAT54JFILM  [SOD323]  100.25,14.9 180 top
VD9  BAT54JFILM  [SOD323]  100.25,16.4 180 top
VD10  BAT54JFILM  [SOD323]  100.25,13.4 180 top
VD11  BAT54JFILM  [SOD323]  96.25,17.9 0 top
VD12  BAT54JFILM  [SOD323]  96.25,14.9 0 top
VD13  BAT54JFILM  [SOD323]  96.25,16.4 0 top
VD14  BAT54JFILM  [SOD323]  96.25,13.4 0 top
VD15  BAV21WS  [SOD323]  74.25,15.7 0 top
VD16  BAV21WS  [SOD323]  74.9,8.85 0 top
VD17  SS34  [DO-214AC(SMA)]  118,19.95 0 top
VD25  SS34  [DO-214AC(SMA)]  136,49.45 0 top
VD26  SS34  [DO-214AC(SMA)]  136,46.45 0 top
XS1  1734037-4  [1734037-4]  54.17,9.52 180 top
XS2  CCDN2,5/18-G1P26THR  [CCDN2.5_18-G1P26THR]  69.2,88.65 0 top
XS4  USB-TYPE-B  [USB-B]  114.95,10.54 180 top
ZD101  MM3Z3V3  [SOD323]  10,58.95 90 top
ZD201  MM3Z3V3  [SOD323]  18,58.95 90 top
ZD301  MM3Z3V3  [SOD323]  26,58.95 90 top
ZD401  MM3Z3V3  [SOD323]  34,58.95 90 top
ZD501  MM3Z3V3  [SOD323]  42,58.95 90 top
ZD601  MM3Z3V3  [SOD323]  50,58.95 90 top
ZD701  MM3Z3V3  [SOD323]  58,58.95 90 top
ZD801  MM3Z3V3  [SOD323]  66,58.95 90 top
ZD901  MM3Z3V3  [SOD323]  74,58.95 90 top
ZD1001  MM3Z3V3  [SOD323]  82,58.95 90 top
ZD1101  MM3Z3V3  [SOD323]  90,58.95 90 top
ZD1201  MM3Z3V3  [SOD323]  98,58.95 90 top
ZD1301  MM3Z3V3  [SOD323]  106,58.95 90 top
ZD1401  MM3Z3V3  [SOD323]  114,58.95 90 top
ZD1501  MM3Z3V3  [SOD323]  122,58.95 90 top
ZD1601  MM3Z3V3  [SOD323]  130,58.95 90 top
ZQ1  8MHz  [OSCILLATOR-3.2X2.5-4P]  148.25,26.25 180 top

## Tracks (layer width: path | path; a pad name or v marks a point on that pad's centre or on a via)
1N  (via drill 0.3 pad 0.6)
  Top 0.2: R15.2 93.62,18.55 96.45,18.55 arc-90 96.95,18.05 96.95,17.9 VD11.C VD7.C 99.55,17.9 99.55,18.15 arc-90 100.05,18.65 104.43,18.65 arc-45 107.96,17.19 115.82,9.33 arc45 117.94,8.45 120.86,8.45 arc45 122.98,9.33 127.76,14.11 arc-45 129.18,14.7 v130.8,14.7
  Bottom 0.2: v130.8,14.7 131.44,14.7 arc-45 131.8,14.55 132.25,14.1 arc45 132.61,13.95 142.5,13.95 142.55,13.9
2N  (via drill 0.3 pad 0.6)
  Top 0.2: R14.2 93.72,15.65 96.45,15.65 arc-90 96.95,15.15 96.95,14.9 VD12.C VD8.C 99.55,14.9 99.55,15.15 arc-90 100.05,15.65 106.03,15.65 arc-45 109.56,14.19 115.22,8.53 arc45 117.34,7.65 121.26,7.65 arc45 123.38,8.53 127.76,12.91 arc-45 129.18,13.5 v130.8,13.5
  Bottom 0.2: v130.8,13.5 131.44,13.5 arc-45 131.8,13.35 131.9,13.25 arc45 132.26,13.1 141.59,13.1 arc-45 141.95,12.95 142.05,12.85 arc45 142.41,12.7 142.55,12.7
4N  (via drill 0.3 pad 0.6)
  Top 0.2: R13.2 93.62,17.15 96.45,17.15 arc-90 96.95,16.65 96.95,16.4 VD13.C VD9.C 99.55,16.4 99.55,16.65 arc-90 100.05,17.15 105.23,17.15 arc-45 108.76,15.69 115.52,8.93 arc45 117.64,8.05 121.06,8.05 arc45 123.18,8.93 127.76,13.51 arc-45 129.18,14.1 v131.4,14.1
  Bottom 0.2: v131.4,14.1 131.44,14.1 arc-45 131.8,13.95 132.05,13.7 arc45 132.41,13.55 141.79,13.55 arc-45 142.15,13.4 arc45 142.4,13.3 143.1,13.3
8N  (via drill 0.3 pad 0.6)
  Top 0.2: R12.2 93.72,14.15 96.45,14.15 arc-90 96.95,13.65 96.95,13.4 VD14.C VD10.C 99.55,13.4 99.55,13.65 arc-90 100.05,14.15 106.83,14.15 arc-45 110.36,12.69 114.92,8.13 arc45 117.04,7.25 121.46,7.25 arc45 123.58,8.13 127.71,12.26 arc-45 129.25,12.9 v131.4,12.9
  Bottom 0.2: v131.4,12.9 131.45,12.85 arc45 131.81,12.7 141.39,12.7 arc-45 141.75,12.55 142.05,12.25 arc45 142.41,12.1 143.1,12.1
!NRST  (2 unrouted)
  Top 0.2: 147,20.3 DD1.14 147,23.72 145.2,25.52 C11.2 | R3.1 158.28,13.8
ADC0  (1 unrouted)
  Top 0.2: DD1.23 142.5,22.75 139.1,22.75 115.4,46.45 99.3,46.45 99.3,59.45
  Top 0.5: R101.P$1 R102.P$2 8,61.9 C101.2 9.62,59.68 ZD101.C
ADC1  (1 unrouted)
  Top 0.2: DD1.24 142,22.25 138.9,22.25 115.2,45.95 91.3,45.95 91.3,59.55
  Top 0.5: R201.P$1 R202.P$2 16,61.9 C201.2 17.62,59.68 ZD201.C
ADC2  (1 unrouted)
  Top 0.2: DD1.25 141.5,21.75 138.7,21.75 115,45.45 87,45.45 87,53.15 84.2,55.95 84.2,56.05 83.3,56.95 83.3,59.65
  Top 0.5: R301.P$1 R302.P$2 24,61.9 C301.2 25.62,59.68 ZD301.C
ADC3  (1 unrouted)
  Top 0.2: DD1.26 139.3,19.55 139.3,20.55 114.9,44.95 75.3,44.95 75.3,59.25
  Top 0.5: R401.P$1 R402.P$2 32,61.9 C401.2 33.62,59.68 ZD401.C
ADC4  (1 unrouted)
  Top 0.2: DD1.29 135.2,18.05 135.2,23.85 114.6,44.45 67.3,44.45 67.3,59.55
  Top 0.5: R501.P$1 R502.P$2 40,61.9 C501.2 41.62,59.68 ZD501.C
ADC5  (1 unrouted)
  Top 0.2: DD1.30 134.8,17.55 134.8,23.55 114.4,43.95 59.3,43.95 59.3,59.75
  Top 0.5: R601.P$1 R602.P$2 48,61.9 C601.2 49.62,59.68 ZD601.C
ADC6  (1 unrouted)
  Top 0.2: DD1.31 134.4,17.05 134.4,23.25 114.2,43.45 51.3,43.45 51.3,59.65
  Top 0.5: R701.P$1 R702.P$2 56,61.9 C701.2 57.62,59.68 ZD701.C
ADC7  (1 unrouted)
  Top 0.2: DD1.32 133.9,16.55 133.9,23.05 114,42.95 42.9,42.95 42.9,60.15
  Top 0.5: R801.P$1 R802.P$2 64,61.9 C801.2 65.62,59.68 ZD801.C
ADC8  (1 unrouted)
  Top 0.2: DD1.35 132.4,15.05 132.4,22.65 113.6,41.45 19.3,41.45 19.3,59.65
  Top 0.5: R901.P$1 R902.P$2 72,61.9 C901.2 73.62,59.68 ZD901.C
ADC9  (1 unrouted)
  Top 0.2: DD1.36 131.9,14.55 131.9,22.45 113.4,40.95 11.3,40.95 11.3,59.05
  Top 0.5: R1001.P$1 R1002.P$2 80,61.9 C1001.2 81.62,59.68 ZD1001.C
ADC10  (1 unrouted)
  Top 0.2: DD1.15 146.5,23.65 141.5,28.65 135.7,28.65 131.3,33.05 131.3,59.65
  Top 0.5: R1101.P$1 R1102.P$2 88,61.9 C1101.2 89.62,59.68 ZD1101.C
ADC11  (1 unrouted)
  Top 0.2: DD1.16 146,23.58 141.43,28.15 135.6,28.15 123.3,40.45 123.3,59.35
  Top 0.5: R1201.P$1 R1202.P$2 96,61.9 C1201.2 97.62,59.68 ZD1201.C
ADC12  (1 unrouted)
  Top 0.2: DD1.17 145.5,23.52 141.37,27.65 135.5,27.65 115.7,47.45 115.3,47.85 115.3,59.45
  Top 0.5: R1301.P$1 R1302.P$2 104,61.9 C1301.2 105.62,59.68 ZD1301.C
ADC13  (1 unrouted)
  Top 0.2: DD1.18 145,23.45 141.3,27.15 135.4,27.15 115.6,46.95 107.3,46.95 107.3,59.65
  Top 0.5: R1401.P$1 R1402.P$2 112,61.9 C1401.2 113.62,59.68 ZD1401.C
ADC14  (1 unrouted)
  Top 0.2: DD1.33 133.4,16.05 133.4,22.95 113.9,42.45 34.9,42.45 34.9,60.05
  Top 0.5: R1501.P$1 R1502.P$2 120,61.9 C1501.2 121.62,59.68 ZD1501.C
ADC15  (1 unrouted)
  Top 0.2: DD1.34 132.9,15.55 132.9,22.75 113.7,41.95 27.3,41.95 27.3,59.65
  Top 0.5: R1601.P$1 R1602.P$2 128,61.9 C1601.2 129.62,59.68 ZD1601.C
BOOT0  (via drill 0.3)  (1 unrouted)
  Top 0.2: v164.8,25.45 165.14,25.11 arc-45 165.72,23.7 165.72,21.75
  Top 0.3: 165.72,21.75 R7.2
  Bottom 0.2: 163.8,28.35 163.8,27.33 arc45 164.39,25.91 164.8,25.5 v164.8,25.45 | 150.1,19.35 150.1,28.35 163.8,28.35 | SB3.1 163.8,28.35
BOOT1
  Top 0.3: DD1.37 137.32,14.05 R2.2
BOOT4
  Top 0.6: IC1.1 145.18,50.36 C44.1
BOOT5
  Top 0.6: IC2.1 12.9,29.27 C51.1
CN1  (via drill 0.3 pad 0.6)
  Top 0.2: SA1.C_1 103.45,10.25 arc90 104.45,9.25 106.18,9.25 arc-45 108.09,8.46 109.11,7.44 arc45 110.53,6.85 121.66,6.85 arc45 123.78,7.73 127.76,11.71 arc-45 129.18,12.3 v130.8,12.3
  Bottom 0.2: SA1.C_1 SA1.C_2 | 142.55,11.5 142.41,11.5 arc-45 142.05,11.65 141.55,12.15 arc45 141.19,12.3 v130.8,12.3
CN2  (via drill 0.3 pad 0.6)
  Top 0.2: v131.4,11.7 129.18,11.7 arc45 127.76,11.11 123.98,7.33 arc-45 121.86,6.45 110.23,6.45 arc-45 108.81,7.04 107.69,8.16 arc45 106.15,8.8 101.83,8.8 arc-45 100.41,9.39 98.54,11.26 arc45 97.12,11.85 95.13,11.85 arc45 93.71,11.26 SA2.C_1
  Bottom 0.2: SA2.C_1 SA2.C_2 | v131.4,11.7 131.6,11.9 140.99,11.9 arc-45 141.35,11.75 142.05,11.05 arc45 142.41,10.9 143.15,10.9
DIN  (via drill 0.4 pad 0.8)  (4 unrouted)
  other vias: 8.5,32.05 8.5,33.05 12.3,32.05 12.3,33.05 142.4,45.95 141.4,45.95 142.4,49.75 141.4,49.75
  pour Top (no thermals): 11.9,28.85 11.9,31.05 arc-90 12.6,31.75 12.6,33.35 8.15,33.35 8.15,31.75 10,31.75 arc-90 11.4,30.35 11.4,28.85
  pour Top (no thermals): 145.6,49.35 143.4,49.35 arc-90 142.7,50.05 141.1,50.05 141.1,45.6 142.7,45.6 142.7,47.45 arc-90 144.1,48.85 145.6,48.85
EN  (3 unrouted)
  Top 0.2: 7.72,30.75 arc-90 8.22,31.25 9.66,31.25 arc-90 10.16,30.75 10.16,29.93 IC2.3 | 143.7,45.18 arc-90 143.2,45.68 143.2,47.12 arc-90 143.7,47.62 144.52,47.62 IC1.3
GND  (via drill 0.3 pad 0.6, 0.4 pad 0.8)  (307 unrouted)
  Top 0.6: IC2.7 11.63,26.2 v12.1,26.2 | IC1.7 148.25,49.09 v148.25,49.55
  Bottom 1: 162.45,92.3 162.45,80.91 arc45 163.38,78.67 164.52,77.53 arc-45 165.7,74.68 165.7,35.15
  other vias: 151.35,25.15 152.55,28.25 151.3,28.25 145.15,29.9 141.3,26.4 140.35,26.4 139.1,26.4 138.25,19.4 152.7,3.8 137.05,5 127.9,17.3 127.25,17.3 126.6,17.3 125.95,18.05 129.85,20.45 130.95,21.3 153.9,18.8 123.9,17.5 123.05,18.5 121.3,16 91.15,18.25 91.15,14.25 67.45,20.95 67.45,21.65 56.35,19.55 56.05,21.35 54.35,20.65 51.35,20.95 141.25,8.1 148.85,28.5 157.45,5.15 157.95,23.5 144,20.05 154.35,4.2 163.15,20.9 159.35,10 159.35,9.3 161.35,9.85 161.35,9.25 164.45,10.3 164.35,12.1 163.05,13.1 163.15,6.8 159.35,6.6 164.15,3.9 139.85,6.7 158.25,3.3 158.85,32.65 160.7,113.65 154.1,112.15 157.35,113.05 164.9,35.05 164.9,34.45 162.8,32.05 164.9,33.85 163.3,31.55 163.8,31.05 165.22,109.42 157.95,103.34 131.3,116.95 143.15,117.15 139.25,114.2 133.55,112.9 159.4,108.08 86.15,14 86.15,9 89.85,1.45 120.9,1.25 128.35,5.7 113.85,7.8 97.1,10.6 99.6,11.65 84.2,18.65 147.7,4.6 141.05,18.85 141.85,17.25 146.65,10.5 149.05,16.7 145.95,16.6 158.98,101.29 131.97,91.45 158.4,91.58 164.43,91.73 165.82,106.5 6.5,69.45 6.5,68.45 6.5,67.45 6.5,66.45 6.5,65.45 6.5,64.45 6.5,63.45 6.5,62.45 6.5,61.45 6.5,60.45 6.5,59.45 6.5,58.45 14.5,69.45 14.5,68.45 14.5,67.45 14.5,66.45 14.5,65.45 14.5,64.45 14.5,63.45 14.5,62.45 14.5,61.45 14.5,60.45 14.5,59.45 14.5,58.45 22.5,69.45 22.5,68.45 22.5,67.45 22.5,66.45 22.5,65.45 22.5,64.45 22.5,63.45 22.5,62.45 22.5,61.45 22.5,60.45 22.5,59.45 22.5,58.45 30.5,69.45 30.5,68.45 30.5,67.45 30.5,66.45 30.5,65.45 30.5,64.45 30.5,63.45 30.5,62.45 30.5,61.45 30.5,60.45 30.5,59.45 30.5,58.45 46.5,69.45 46.5,68.45 46.5,67.45 46.5,66.45 46.5,65.45 46.5,64.45 46.5,63.45 46.5,62.45 46.5,61.45 46.5,60.45 46.5,59.45 46.5,58.45 54.5,69.45 54.5,68.45 54.5,67.45 54.5,66.45 54.5,65.45 54.5,64.45 54.5,63.45 54.5,62.45 54.5,61.45 54.5,60.45 54.5,59.45 54.5,58.45 62.5,69.45 62.5,68.45 62.5,67.45 62.5,66.45 62.5,65.45 62.5,64.45 62.5,63.45 62.5,62.45 62.5,61.45 62.5,60.45 62.5,59.45 62.5,58.45 70.5,69.45 70.5,68.45 70.5,67.45 70.5,66.45 70.5,65.45 70.5,64.45 70.5,63.45 70.5,62.45 70.5,61.45 70.5,60.45 70.5,59.45 70.5,58.45 78.5,69.45 78.5,68.45 78.5,67.45 78.5,66.45 78.5,65.45 78.5,64.45 78.5,63.45 78.5,62.45 78.5,61.45 78.5,60.45 78.5,59.45 78.5,58.45 86.5,69.45 86.5,68.45 86.5,67.45 86.5,66.45 86.5,65.45 86.5,64.45 86.5,63.45 86.5,62.45 86.5,61.45 86.5,60.45 86.5,59.45 86.5,58.45 94.5,69.45 94.5,68.45 94.5,67.45 94.5,66.45 94.5,65.45 94.5,64.45 94.5,63.45 94.5,62.45 94.5,61.45 94.5,60.45 94.5,59.45 94.5,58.45 102.5,69.45 102.5,68.45 102.5,67.45 102.5,66.45 102.5,65.45 102.5,64.45 102.5,63.45 102.5,62.45 102.5,61.45 102.5,60.45 102.5,59.45 102.5,58.45 110.5,69.45 110.5,68.45 110.5,67.45 110.5,66.45 110.5,65.45 110.5,64.45 110.5,63.45 110.5,62.45 110.5,61.45 110.5,60.45 110.5,59.45 110.5,58.45 118.5,69.45 118.5,68.45 118.5,67.45 118.5,66.45 118.5,65.45 118.5,64.45 118.5,63.45 118.5,62.45 118.5,61.45 118.5,60.45 118.5,59.45 118.5,58.45 38.5,69.45 38.5,68.45 38.5,67.45 38.5,66.45 38.5,65.45 38.5,64.45 38.5,63.45 38.5,62.45 38.5,61.45 38.5,60.45 38.5,59.45 38.5,58.45 126.5,69.45 126.5,68.45 126.5,67.45 126.5,66.45 126.5,65.45 126.5,64.45 126.5,63.45 126.5,62.45 126.5,61.45 126.5,60.45 126.5,59.45 126.5,58.45 5.15,33 5.15,31.95 14.3,30.95 14.3,30.15 18.5,30.45 19.5,30.45 17.5,30.45 36.5,26.45 35.5,26.45 34.5,26.45 34.5,32.45 35.5,32.45 36.5,32.45 9.9,27.7 9.9,26.2 12.1,27.7 5.2,28.25 5.2,29.5 5.15,30.75 6.15,23.45 5,23.45 141.45,42.6 142.5,42.6 143.5,51.75 144.3,51.75 144,55.95 144,56.95 144,54.95 148,73.95 148,72.95 148,71.95 142,71.95 142,72.95 142,73.95 146.75,47.35 148.25,47.35 146.75,49.55 146.2,42.65 144.95,42.65 143.7,42.6 151,43.6 151,42.45
  pour Bottom (rank 3): 11.9,1.45 0,1.45 0,36.55 166.8,36.55 166.8,0 82.25,0 82.25,15.45 arc90 80.75,16.95 30.85,16.95 arc-90 29.35,18.45 29.35,18.95 arc90 27.85,20.45 14.9,20.45 arc90 11.9,17.45
  pour Top (rank 3): 11.9,1.45 0,1.45 0,35.55 arc-90 1,36.55 166.8,36.55 166.8,0 82.25,0 82.25,15.45 arc90 80.75,16.95 30.85,16.95 arc-90 29.35,18.45 29.35,18.95 arc90 27.85,20.45 14.9,20.45 arc90 11.9,17.45
  pour Top (rank 2): 130,118.5 130,91.45 166.8,91.45 166.8,118.5
  pour Bottom (rank 2): 130,118.5 130,90.45 166.8,90.45 166.8,118.5
  pour Route2: 130,118.5 130,90.45 166.8,90.45 166.8,118.5
  pour Route15: 130,118.5 130,90.45 166.8,90.45 166.8,118.5
  pour Route15 (rank 3): 11.9,1.45 0,1.45 0,36.55 166.8,36.55 166.8,0 82.25,0 82.25,15.45 arc90 80.75,16.95 30.85,16.95 arc-90 29.35,18.45 29.35,18.95 arc90 27.85,20.45 14.9,20.45 arc90 11.9,17.45
  pour Route2 (rank 3): 11.9,1.45 0,1.45 0,36.55 166.8,36.55 166.8,0 82.25,0 82.25,15.45 arc90 80.75,16.95 30.85,16.95 arc-90 29.35,18.45 29.35,18.95 arc90 27.85,20.45 14.9,20.45 arc90 11.9,17.45
GNDD  (via drill 0.3 pad 0.6)  (16 unrouted)
  Bottom 1: v133.9,0.85 163,0.85 arc90 165.9,3.75 165.9,29.71 arc45 165.02,31.83 164.73,32.12 arc-45 163.85,34.24 163.85,74.16
  other vias: 134.5,0.85 135.1,0.85 135.7,0.85
  pour Top (no thermals): 136,0.3 130.1,0.3 130.1,5.45 132.85,5.45 132.85,3.15 arc90 134.85,1.15 136,1.15
  pour Bottom (no thermals): 164.25,74.75 6.2,74.75 6.2,71.85 164.25,71.85
I2C3_SCL  (via drill 0.3, 0.35)
  Top 0.2: DD1.67 149.5,6.95 v149.25,7.2 | PAD2.P$1 136.5,114.65 137.62,113.53 arc45 139.74,112.65 146.72,112.65 arc-45 148.48,111.92 149.14,111.26 arc45 151.88,110.12 157.43,110.12 arc-90 162.3,105.25 162.3,81.08 arc45 162.89,79.66 164.77,77.78 arc-45 165.65,75.66 165.65,29.25 arc-90 163.85,27.45 153.9,27.45 v153.6,27.75
  Bottom 0.2: v149.25,7.2 153,7.2 153,27.25 arc-90 153.5,27.75 v153.6,27.75
I2C3_SDA  (via drill 0.3, 0.35)
  Top 0.2: DD1.66 v149,4.8 | PAD3.P$1 146.5,114.65 149.65,111.5 arc45 151.71,110.65 157.45,110.65 arc-90 162.8,105.3 162.8,81.18 arc45 163.39,79.76 165.17,77.98 arc-45 166.05,75.86 166.05,29.25 arc-90 163.85,27.05 153.7,27.05 v153.6,26.95
  Bottom 0.2: v149,4.8 152.7,4.8 153.47,5.57 153.47,26.54 arc-45 153.55,26.9 v153.6,26.95
ISO24V
  pour Top (no thermals): 15,17.55 15,11.73 arc45 15.59,10.31 18.61,7.29 arc-45 19.2,5.87 19.2,4.25 20.55,4.25 20.55,4.65 arc-90 22.55,6.65 26.75,6.65 26.75,11.7 20.5,11.7 arc-90 18.5,13.7 18.5,17.55
MCU_RX1  (1 unrouted)
  Top 0.2: U13.3 48.1,20.75 48.1,19.45 arc90 49.8,17.75 81.1,17.75 arc-90 83.3,15.55 83.3,7.05 arc90 85.4,4.95 88.03,4.95 arc-45 89.09,4.51 89.31,4.29 arc45 90.37,3.85 122.26,3.85 arc45 124.38,4.73 128.91,9.26 arc-45 130.33,9.85 132.6,9.85
MCU_RX2
  Route2 0.3: CON3.3 128.4,2.01 arc-45 129.82,2.6 137.12,2.6 arc45 139.25,3.48 140.05,20.4
MCU_RX6  (2 unrouted)
  Top 0.2: U7.3 64.11,20.75 64.11,19.75 arc90 64.91,18.95 81.1,18.95 arc-90 84.5,15.55 84.5,8.2 arc90 85.5,7.2 87.3,7.2 arc45 88,7.49 88.07,7.56 arc-45 88.78,7.85 105.67,7.85 arc-45 107.09,7.26 108.31,6.04 arc45 109.73,5.45 121.96,5.45 arc45 124.08,6.33 128.26,10.51 arc-45 129.68,11.1 132.45,11.1
  Bottom 0.2: 133.65,11.3 134.19,11.3 arc-45 134.89,11.01 136.01,9.89 arc45 136.71,9.6 145.7,9.6
MCU_TX1  (1 unrouted)
  Top 0.2: U13.6 44.3,20.75 44.3,19.15 arc90 46.49,16.95 81,16.95 arc-90 82.5,15.45 82.5,7.05 arc90 85.4,4.15 87.53,4.15 arc-45 88.59,3.71 88.81,3.49 arc45 89.87,3.05 122.66,3.05 arc45 124.78,3.93 129.31,8.46 arc-45 130.73,9.05 132.6,9.05
MCU_TX2  (via drill 0.3 pad 0.6)
  Route2 0.3: CON3.2 125.6,2.27 arc-90 127.6,4.28 136.72,4.28 arc90 140.82,8.37 v142.7,19.22
MCU_TX6  (2 unrouted)
  Top 0.2: U7.6 60.3,20.75 60.3,19.65 arc90 61.8,18.15 81.1,18.15 arc-90 83.7,15.55 83.7,8.2 arc90 85.5,6.4 87.76,6.4 arc45 88.47,6.69 88.48,6.71 arc-45 89.19,7 105.27,7 arc-45 106.69,6.41 107.91,5.19 arc45 109.33,4.6 122.31,4.6 arc45 124.43,5.48 128.66,9.71 arc-45 130.08,10.3 133.14,10.3
  Bottom 0.2: 134.45,9.5 134.69,9.5 arc-45 135.39,9.21 135.51,9.09 arc45 136.21,8.8 144.19,8.8 arc-45 144.55,8.65 144.65,8.55 arc45 145.01,8.4 145.7,8.4
N$1
  Top 0.3: C2.2 137.53,8.55 DD1.48
N$2  (1 unrouted)
N$3
  Top 0.2: CON5.5 161.37,14.05 159.72,14.05 R3.2
N$4
  Top 0.2: DD1.12 148,24.15 arc-45 148.1,24.4 arc45 148.25,24.76 148.25,26.2 arc-90 148.75,26.7 149.4,26.7 ZQ1.1 149.6,27.15 149.68,27.22 151.1,27.22 C6.1
N$5
  Top 0.2: DD1.13 147.5,24.95 ZQ1.3 146.97,25.35 146.1,26.22 146.1,28.43 C5.2
N$6
  Top 0.2: CON5.4 163.16,15.84 arc-45 162.46,15.55 159.72,15.55 R4.2
N$7
  Top 0.2: R5.2 159.72,17.05 161.63,17.05 CON5.3
N$8
  Top 0.2: CON5.2 163.32,18.54 arc-45 162.62,18.25 159.72,18.25 R6.2
N$17
  Top 0.2: DA9.2 76.1,12.8 78.59,12.8 arc45 79.29,13.09 79.38,13.18 U10.2
N$18
  Top 0.2: R17.2 R18.1 75,13.92 75,11.4 arc90 75.5,10.9 76.1,10.9 DA9.1
N$19
  Top 0.2: U10.1 79.81,15.7 R16.1
N$20
  Top 0.2: VD15.C R16.2 76.97,15.5 76.97,15.35 arc90 77.47,14.85 77.53,14.85 arc-90 78.03,14.35 78.03,14.15 R17.1
N$21
  Top 0.3: HL1.A R25.2
N$22
  Top 0.152: DA11.2 76.52,6.07 78.17,6.07 arc90 79.17,7.07 79.17,8.18 U14.2
N$23
  Top 0.2: R21.2 75,7.2 | 75,7.2 R22.1 | DA11.1 76.1,4.15 75.5,4.15 arc-90 75,4.65 75,7.2
N$24
  Top 0.2: R19.1 79.77,10.77 U14.1
N$25
  Top 0.2: R21.1 77.59,7.31 77.65,7.38 77.65,8.85 | 77.65,8.85 VD16.C | R19.2 77.65,9.07 77.65,8.85
N$26
  Top 0.3: R26.2 HL2.A
N$28  (1 unrouted)
  Top 0.2: IC1.4 145.5,46.55 145.5,44.93
N$30
  Top 0.2: R37.2 C47.2 150.15,45.28 151.05,45.28 arc90 151.55,45.78 151.55,47.12 arc90 151.05,47.62 150.48,47.62 IC1.6
N$31
  Top 0.2: R37.1 148.7,42.45 C46.2
N$32
  Top 0.2: 150.6,46.55 IC1.5 150.08,46.35 148.7,46.35 arc90 147.8,45.45 147.8,45.08 R38.1 R39.2
N$33  (1 unrouted)
  Top 0.2: IC2.4 9.1,28.95 7.47,28.95
N$34
  Top 0.2: R27.2 C54.2 7.83,24.3 7.83,23.4 arc90 8.32,22.9 9.66,22.9 arc90 10.16,23.4 10.16,23.97 IC2.6
N$35
  Top 0.2: R27.1 5,25.75 C53.2
N$36
  Top 0.2: 9.1,23.85 IC2.5 8.89,24.37 8.89,25.75 arc90 8,26.65 7.62,26.65 R28.1 R29.2
N$37
  Top 0.3: 150,3.78 R26.1
N$43  (via drill 0.3)
  Top 0.2: U7.9 v57.55,13.64 v57.55,13.65 | R11.2 68.05,13.65 v66.5,13.65 66.44,13.59 U7.16
  Bottom 0.2: v57.55,13.65 v66.5,13.65
N$46
  Top 0.3: C20.1 55.75,13.67 C21.1 53.7,13.67 53.7,13.95 arc90 53.2,14.45 50.33,14.45 arc90 49.33,13.45 49.33,12.1 U13.15
N$47
  Top 0.5: PAD4.P$1 151.5,113.67 C24.2 155.97,113.67 156.35,114.05 DA8.2
N$48
  Top 0.2: VD15.A 73.15,15.5 73.75,15.5 arc-90 74.25,15 74.25,13.71 arc-45 73.96,13.01 73.19,12.24 arc45 72.9,11.54 72.9,10.7 arc-90 71.9,9.7 70.1,9.7 arc90 67.35,6.95 67.35,2.2 arc-90 66.1,0.95 55.85,0.95 arc-45 54.54,1.49 XS1.A5
  Top 1: XS1.A5 arc-90 51.95,0.9 43.55,0.9 arc-58 41.85,1.85 39.59,5.5 arc58 37.88,6.45 VD4.C 31.73,6.45 arc-45 30.31,7.04 VD1.A
  Top 1.5: XS1.B5 XS1.A5
N$49  (via drill 0.3 pad 0.6)
  Top 0.2: VD16.A 69.8,8.85 arc90 67.8,6.85 67.8,1.95 arc-90 66.3,0.45 54.85,0.45 arc-45 v54.25,0.7
  Top 1: VD2.A 30.56,10.29 arc45 31.98,9.7 33.25,9.7 VD3.C
  Top 1.5: XS1.B6 XS1.A6
  Bottom 0.6: 54.48,0.9 54.48,0.7 v54.25,0.7
  Bottom 1: XS1.A6 arc-90 54.48,0.9 43.56,0.9 arc-58 41.86,1.84 37.75,8.46 arc58 36.05,9.4 35.65,9.4
  other vias: 35.4,9.85 35.4,9.2 36.05,9.2 36.05,9.85
  pour Bottom: 36.3,10.05 35.2,10.05 35.2,9 36.3,9
  pour Top: 32.5,10.1 36.3,10.1 36.3,8.8 32.5,8.8
N$51
  Top 0.3: U7.14 63.76,12.1 63.76,13.2 arc90 63.26,13.7 60.74,13.7 arc90 60.24,13.2 60.24,12.1 U7.11 60.24,11.8 60.24,10.81 arc45 60.54,10.1 XS1.D9
N$53
  Top 0.3: U7.12 61.52,11.8 61.52,10.7 arc90 62.02,10.2 62.63,10.2 | 62.63,10.2 U7.13 | XS1.D10 64.62,8.21 62.63,10.2
N$69  (via drill 0.3)
  Top 0.2: U13.9 41.55,13.6 v41.6,13.65 | U13.16 v50.45,13.64 v50.45,13.65 52.05,13.65 R10.2
  Bottom 0.2: v50.45,13.65 v41.6,13.65
N$70
  Top 0.2: XS4.2 114.31,14.64 arc-45 114.9,13.22 114.9,13.11 arc135 116.85,12.3 116.92,12.37 arc-45 119.89,13.6 123.85,13.6 arc-90 124.35,13.1 124.35,12.88 R9.2
N$71
  Top 0.2: R8.2 123.15,13.12 120.01,13.12 arc45 117.07,11.91 arc-90 115.04,11.91 XS4.3
N$72
  Top 0.5: XS4.1 116.1,15.35 VD17.A
N$74
  Top 0.3: XS1.D1 43.65,9.75 arc45 43.95,10.46 43.95,11.8 U13.11 44.24,12.1 44.24,13.4 arc-90 44.74,13.9 47.26,13.9 arc-90 47.76,13.4 47.76,12.1 U13.14
N$75
  Top 0.3: U13.12 45.22,11.8 45.22,10.2 | 45.22,10.2 45.22,8.78 XS1.D2 | U13.13 46.48,11.8 46.48,10.7 arc-90 45.98,10.2 45.22,10.2
N$82
  Top 0.3: C17.1 71.75,13.67 C18.1 69.7,13.67 69.7,13.95 arc90 69.2,14.45 66.33,14.45 arc90 65.33,13.45 65.33,12.1 U7.15
N$84  (via drill 0.3 pad 0.6)
  Top 0.2: VD7.A 102.35,17.9 v102.4,17.85
  Bottom 0.2: SA1.1 101.51,6.01 arc45 102.1,7.43 102.1,17.14 arc-45 v102.39,17.84 v102.4,17.85
N$85  (via drill 0.3 pad 0.6)
  Top 0.2: v103.1,14.85 103.05,14.9 VD8.A
  Bottom 0.2: SA1.2 105.96,10.49 103.54,12.91 arc-45 103.1,13.98 v103.1,14.85
N$86  (via drill 0.3 pad 0.6)
  Top 0.2: VD9.A 102.75,16.4 v102.8,16.35
  Bottom 0.2: v102.8,16.35 v102.79,16.34 arc45 102.5,15.64 102.5,13.88 arc45 103.09,12.46 103.91,11.64 arc-45 104.5,10.22 104.5,7.73 arc45 105.09,6.31 SA1.4
N$90
  Top 0.2: VD10.A 100.95,13.4 100.95,10.53 SA1.8
N$92  (via drill 0.3 pad 0.6)
  Top 0.2: v96.1,17.95 96.05,17.9 VD11.A
  Bottom 0.2: SA2.1 91.21,6.21 arc45 91.8,7.63 91.8,10.12 arc-45 92.39,11.54 93.21,12.36 arc45 93.8,13.78 93.8,14.82 arc-45 94.39,16.24 v96.1,17.95
N$93  (via drill 0.3 pad 0.6)
  Top 0.2: VD12.A 96.05,14.9 v96.1,14.95
  Bottom 0.2: v96.1,14.95 96.09,14.94 arc45 95.5,13.52 SA2.2
N$94  (via drill 0.3 pad 0.6)
  Top 0.2: VD13.A 95.2,16.35 v96.1,16.35
  Bottom 0.2: SA2.4 94.89,6.01 arc-45 94.3,7.43 94.3,13.72 arc-45 94.89,15.14 v96.1,16.35
N$98
  Top 0.2: VD14.A 95.15,13.2 93.95,13.2 arc45 92.53,12.61 SA2.8
NAMUR0
  Top 0.5: 11.25,69.65 C102.P$2 | C102.P$2 R103.P$2 R101.P$2 | C102.P$2 11.05,72.75 F101.1 11.25,77.65 20.7,77.65 XS2.B18
NAMUR1
  Top 0.5: 19.25,69.65 C202.P$2 | C202.P$2 R203.P$2 R201.P$2 | C202.P$2 19.05,72.75 F201.1 19.25,75.95 24,75.95 XS2.B17
NAMUR2
  Top 0.5: 27.25,69.65 C302.P$2 | C302.P$2 R303.P$2 R301.P$2 | C302.P$2 27.05,72.75 F301.1 27.25,74.2 XS2.B16
NAMUR3
  Top 0.5: 35.25,69.65 C402.P$2 | C402.P$2 R403.P$2 R401.P$2 | C402.P$2 35.05,72.75 | 35.05,72.75 F401.1 | XS2.B15 35.05,77 35.05,72.75
NAMUR4
  Top 0.5: 43.25,69.65 C502.P$2 | C502.P$2 R503.P$2 R501.P$2 | C502.P$2 43.05,72.75 F501.1 43.25,80.2 XS2.B14
NAMUR5
  Top 0.5: 51.25,69.65 C602.P$2 | C602.P$2 R603.P$2 R601.P$2 | C602.P$2 51.05,72.75 F601.1 51.25,83.2 XS2.B13
NAMUR6
  Top 0.5: 59.25,69.65 C702.P$2 | C702.P$2 R703.P$2 R701.P$2 | C702.P$2 59.05,72.75 F701.1 59.25,81.1 XS2.B12
NAMUR7
  Top 0.5: 67.25,69.65 C802.P$2 | C802.P$2 R803.P$2 R801.P$2 | C802.P$2 67.05,72.75 F801.1 67.25,78.1 XS2.B11
NAMUR8
  Top 0.5: 75.25,69.65 C902.P$2 | C902.P$2 R903.P$2 R901.P$2 | C902.P$2 75.05,72.75 F901.1 75.25,82.2 XS2.B8
NAMUR9
  Top 0.5: 83.25,69.65 C1002.P$2 | C1002.P$2 R1003.P$2 R1001.P$2 | C1002.P$2 83.05,72.75 F1001.1 83.25,82.1 XS2.B7
NAMUR10
  Top 0.5: 91.25,69.65 C1102.P$2 | C1102.P$2 R1103.P$2 R1101.P$2 | C1102.P$2 91.05,72.75 F1101.1 91.25,79.1 XS2.B6
NAMUR11
  Top 0.5: 99.25,69.65 C1202.P$2 | C1202.P$2 R1203.P$2 R1201.P$2 | C1202.P$2 99.05,72.75 | 99.05,72.75 F1201.1 | XS2.B5 99.05,76.3 99.05,72.75
NAMUR12
  Top 0.5: 107.25,69.65 C1302.P$2 | C1302.P$2 R1303.P$2 R1301.P$2 | C1302.P$2 107.05,72.75 F1301.1 107.25,74.45 105.9,74.45 XS2.B4
NAMUR13
  Top 0.5: 115.25,69.65 C1402.P$2 | C1402.P$2 R1403.P$2 R1401.P$2 | C1402.P$2 115.05,72.75 F1401.1 115.25,75.95 109.4,75.95 XS2.B3
NAMUR14  (1 unrouted)
  Top 0.5: 123.25,69.65 C1502.P$2 | C1502.P$2 R1503.P$2 R1501.P$2 | C1502.P$2 123.05,72.75 | XS2.B2 112.9,77.45 123.05,77.45 123.05,73.15 F1501.1
NAMUR15
  Top 0.5: 131.25,69.65 C1602.P$2 | C1602.P$2 R1603.P$2 R1601.P$2 | C1602.P$2 131.05,72.75 F1601.1 131.25,79.15 116.2,79.15 XS2.B1
PGND  (via drill 0.3 pad 0.6)
  other vias: 34.5,11.95 33.5,11.95 32.5,11.95 34.5,4.2 33.5,4.2 32.5,4.2 26,16.95 26,15.95 26,14.95 24.25,14.2 23.25,14.2 22.25,14.2 72.45,7.2 72.55,4.7 70,11.2 73.9,10.3 65.4,10.05
  pour Bottom (rank 3): 21.15,-0.05 74.5,-0.05 74.5,14.6 28,14.6 arc-90 26.5,16.1 26.5,17.6 21.15,17.6
  pour Top (rank 3): 21.15,-0.05 74.5,-0.05 74.5,14.6 28,14.6 arc-90 26.5,16.1 26.5,17.6 21.15,17.6
  pour Route15 (rank 3): 21.15,-0.05 74.5,-0.05 74.5,14.6 28,14.6 arc-90 26.5,16.1 26.5,17.6 21.15,17.6
  pour Route2 (rank 3): 21.15,-0.05 74.5,-0.05 74.5,14.6 28,14.6 arc-90 26.5,16.1 26.5,17.6 21.15,17.6
REDE1
  Top 0.2: U13.5 U13.4 46.84,20.75 46.84,19.05 arc90 48.53,17.35 81.05,17.35 arc-90 82.9,15.5 82.9,7.05 arc90 85.4,4.55 87.78,4.55 arc-45 88.84,4.11 89.06,3.89 arc45 90.12,3.45 122.46,3.45 arc45 124.58,4.33 129.11,8.86 arc-45 130.53,9.45 132.6,9.45
REDE2  (2 unrouted)
  Top 0.2: U7.5 U7.4 62.84,20.75 62.84,19.55 arc90 63.84,18.55 81.1,18.55 arc-90 84.1,15.55 84.1,8.2 arc90 85.5,6.8 87.55,6.8 arc45 88.25,7.09 88.32,7.16 arc-45 89.03,7.45 105.47,7.45 arc-45 106.89,6.86 108.11,5.64 arc45 109.53,5.05 122.16,5.05 arc45 124.28,5.93 128.46,10.11 arc-45 129.88,10.7 132.14,10.7
  Bottom 0.2: 134.45,10.3 134.49,10.3 arc-45 135.19,10.01 135.71,9.49 arc45 136.41,9.2 144.69,9.2 arc-45 145.05,9.05 145.1,9
SPI2_CLK  (1 unrouted)
  Top 0.2: DS1.6 160.56,4.05 157.86,6.76 arc45 157.15,7.05 156.2,7.05
SPI2_CS  (1 unrouted)
  Top 0.2: DS1.1 162.91,11.35 162.91,9.45 arc-90 161,7.55 156.2,7.55
SPI2_MISO  (1 unrouted)
  Top 0.2: DS1.2 162.03,11.35 162.03,9.25 arc-90 161.34,8.55 156.2,8.55
SPI2_MOSI  (1 unrouted)
  Top 0.2: DS1.5 159.29,4.15 157.09,6.36 arc45 156.38,6.65 156.2,6.65
SW10
  pour Top (no thermals): 12.7,23.25 18.9,23.25 arc90 23.8,28.15 23.8,31.05 22.25,31.05 22.25,29.8 arc-90 19.1,26.65 14.2,26.65 12.7,25.15
SW11
  pour Top (no thermals): 151.2,50.15 151.2,56.35 arc90 146.3,61.25 143.4,61.25 143.4,59.7 144.65,59.7 arc-90 147.8,56.55 147.8,51.65 149.3,50.15
SWC  (1 unrouted)
  Top 0.2: 159,21.45 159,17.55 arc-90 158.5,17.05 158.28,17.05 R5.1
SWD  (1 unrouted)
  Top 0.2: 158.12,18.05 R6.1
SWO  (via drill 0.35)
  Top 0.2: v157.25,16.35 157.3,16.35 158.28,15.38 R4.1
  Bottom 0.2: v157.25,16.35 154.68,18.92 arc45 154,19.2
U1TS  (via drill 0.3 pad 0.6)
  Top 0.2: R20.1 142.82,2.65 143.85,2.65 v144,2.8 | U10.4 86.68,15.72 87.06,15.34 arc-45 87.65,13.92 87.65,11.45 arc90 90.05,9.05 98.65,9.05 v98.95,9.35
  Route15 0.2: v144,2.8 143.21,4.35 arc-45 142.24,3.95 100.6,3.95 arc-90 98.9,5.65 98.9,9.3 v98.95,9.35
U2TS  (via drill 0.3 pad 0.6)
  Top 0.2: v144,1.95 143.84,1.79 arc-45 143.14,1.5 142.72,1.5 R23.1 | U14.4 86.58,10.72 87.95,9.34 arc45 90.11,8.45 99.55,8.45 v99.7,8.6
  Route15 0.2: v144,1.95 145.38,5.1 arc90 142.95,5.1 142.59,4.74 arc-45 141.89,4.45 100.7,4.45 arc-90 99.7,5.45 v99.7,8.6
USB_DM  (via drill 0.3 pad 0.6)  (1 unrouted)
  Top 0.2: v127.65,15.35 127.6,15.4 126.4,15.4 125.8,16 125.71,16 arc45 125.01,15.71 125,15.7 VD6.3 124.95,14.32 R9.1 | DD1.70 150.95,5.9
  Bottom 0.2: 146.4,15.75 146.39,15.76 arc45 145.69,16.05 128.35,16.05 v127.65,15.35
USB_DP  (via drill 0.3 pad 0.6)  (1 unrouted)
  Top 0.2: DD1.71 151.45,5.9 | VD6.2 123.25,15.7 | 123.25,15.7 123.25,14.47 R8.1 | v127.65,16.2 127.76,16.09 arc-45 127.02,16.4 123.75,16.4 arc90 123.25,15.9 123.25,15.7
  Bottom 0.2: v127.65,16.2 arc45 128.5,16.55 145.6,16.55 146.4,16.55
VDD_3V3  (via drill 0.3, 0.3 pad 0.6)  (12 unrouted)
  Top 0.2: 141.95,24.07 C7.2 | DD1.6 151,20.4 arc90 151.5,19.9 v152.05,19.9 | DS1.8 DS1.7
  Top 0.3: DD1.11 148.5,22.6 arc-90 150.25,24.35 151.65,24.35 arc90 152.25,24.95 v152.25,25.1 152.25,25.97 C1.2 | DD1.21 143.5,22.75 143,22.75 DD1.22 | DD1.28 135.88,18.55 C4.2 135.88,20.32 v136,20.45 | DS1.8 162.97,3.42 162.97,1.85 C12.2 | 155.18,5.4 C9.2 155.18,4.08 v155.2,4.05 | DD1.100 155.7,19.55 156.2,20.05 v156.3,20.05 156.3,20.15 156.86,20.71 C10.1 | C3.2 137.78,7.55 DD1.50
  Top 0.4: C27.2 131.2,18.97 | C1.2 152.65,26.07
  Top 0.6: C14.2 C13.2 C7.2 | v137.25,6.2 137.32,6.28 C3.2 | CON5.1 161.73,19.97 arc-45 162.32,21.39 163.21,22.28 arc45 163.8,23.7 SB3.2 | DS1.3 160.56,10.36 arc-45 160.41,10 v160.4,10 | v160.4,6.55 160.84,6.55 arc-90 161.84,5.55 DS1.7
  Bottom 0.3: CON5.1 161.73,19.89
  Bottom 0.6: v130.1,17.05 v129.45,17.05 129.45,4.35 arc90 131.75,2.05 157.7,2.05 arc90 160.4,4.75 v160.4,6.55 v160.4,10 160.4,17.23 arc-45 160.99,18.65 161.73,19.39 CON5.1
  other vias: 140.8,24.2 130.1,17.7 129.45,17.7 141.4,24.2
  pour Top (no thermals): 131.3,19.2 129,19.2 129,16.85 131.3,16.85
  pour Bottom (no thermals): 129.25,17.95 130.3,17.95 130.3,16.85 129.25,16.85
  pour Top (no thermals): 142.55,24.65 142.55,23.9 140.55,23.9 140.55,24.65
VDD_5V  (via drill 0.3 pad 0.6)  (6 unrouted)
  Top 0.2: L4.2 31.95,28.35 31.55,27.95 29,27.95 arc45 25.46,26.49 22.89,23.91 arc-45 19.36,22.45 7.9,22.45 arc-90 6.9,23.45 6.9,26.15 arc90 6.4,26.65 6.17,26.65 R28.2
  Top 0.3: C32.2 54.42,24.07 C33.2 56.15,24.18 56.15,24.75 | U7.7 58.83,24.72 58.85,24.75 | U7.2 65.17,24.72 65.2,24.75
  Top 0.35: U13.2 49.17,24.72
  Top 0.5: 120.31,24.75 120.31,20.36 VD17.C | VD6.4 124.95,20.43 C26.2 | 36.15,30.4 C55.2
  Top 1.5: v162.25,35.85 162.87,36.47 arc45 163.75,38.59 163.75,75.61 arc45 162.87,77.73 161.68,78.92 arc-45 160.77,81.12 160.77,99.21
  Top 2: 49.17,24.75 44.67,24.75 39.98,29.45 34,29.45 | 49.17,24.75 56.15,24.75 58.85,24.75 65.2,24.75 120.31,24.75 123.41,24.75 | 49.17,24.72 49.17,24.75
  Bottom 0.2: 63.4,36 63.25,35.85
  other vias: 161.6,35.85 161,35.85 160.45,99.75 160.8,99.2 160.6,112.15 161.2,112.15 160.9,111.6
  pour Top (no thermals): 121.9,21.6 128.85,21.6 128.85,20.4 125.75,20.4 125.2,19.85 121.9,19.85
  pour Bottom: 162.9,35.2 160.65,35.2 160.65,36.5 162.9,36.5
  pour Top: 160.8,35.2 162.45,35.2 162.45,36.5 160.8,36.5
  pour Top: 160.12,98.8 161.43,98.8 161.43,100.1 160.12,100.1
  pour Bottom: 161.45,98.95 160.25,98.95 160.25,112.45 161.45,112.45
  pour Top (no thermals): 156.95,111.35 161.45,111.35 161.45,112.45 156.95,112.45
  pour Top (no thermals): 31.2,27.95 36.7,27.95 36.7,30.95 31.2,30.95
  pour Top (no thermals): 146.5,68.65 146.5,74.15 143.5,74.15 143.5,68.65
VDD_8V2  (21 unrouted)
VDD_24V  (5 unrouted)

## Text on the board
tPlace: RLT508.02 | 1 | 2
tStop: EBCDSGN